# Altium project FishWand.PrjPcb
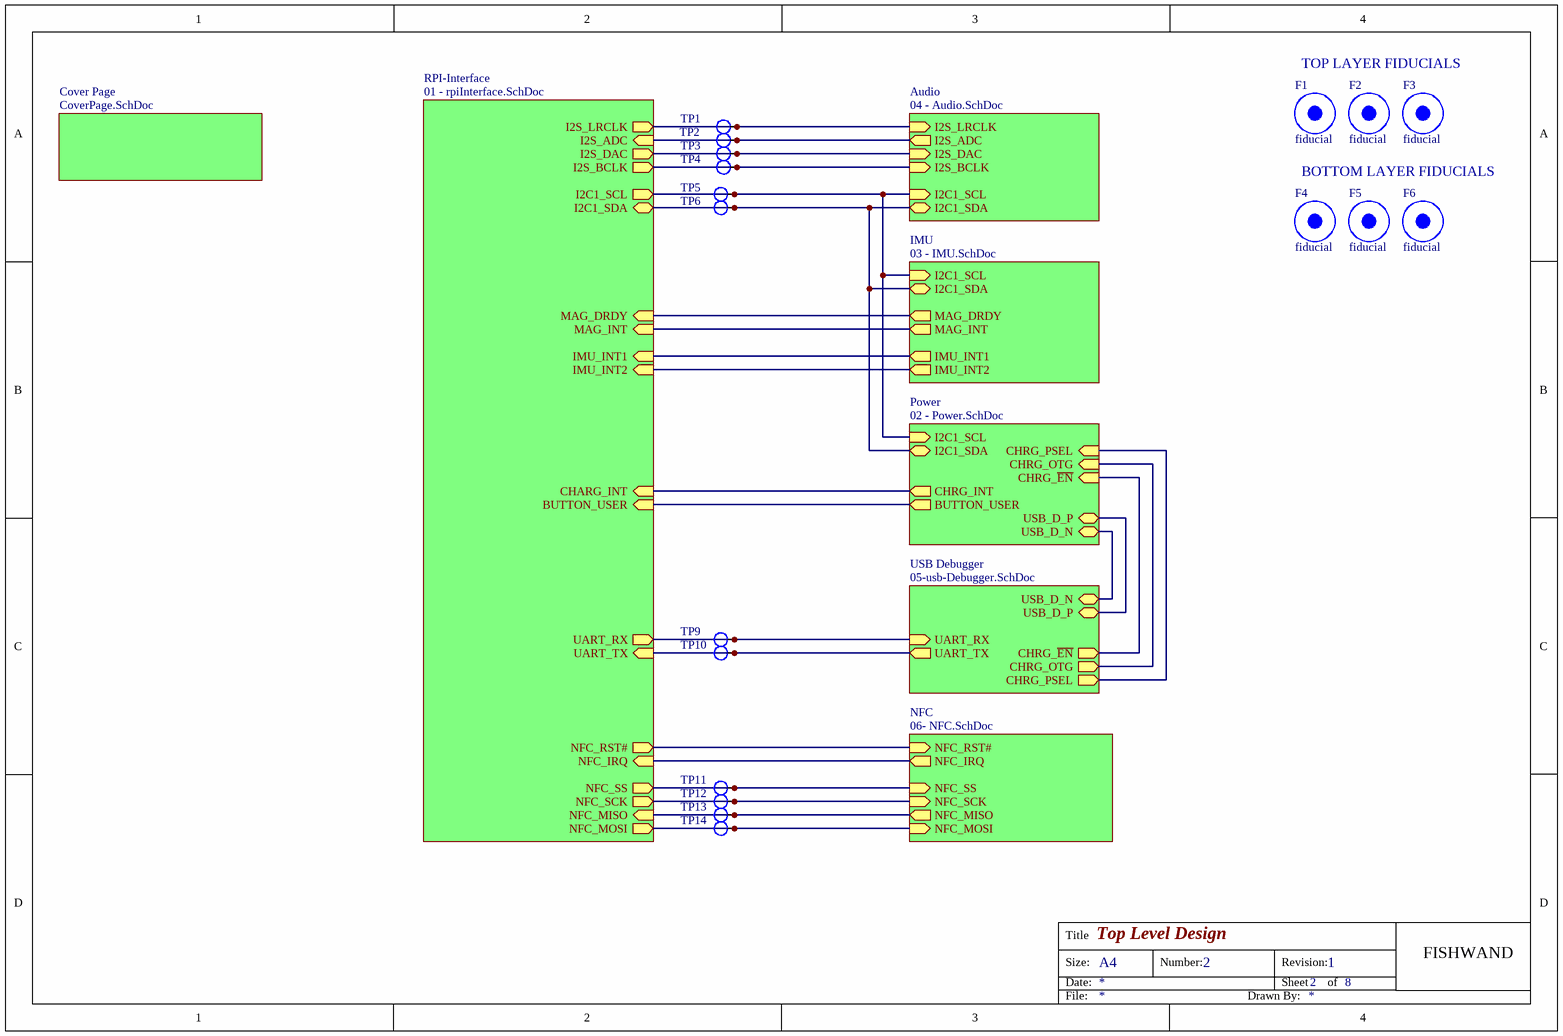
[diagram p0: 00 - TitlePage.SchDoc]
8 sheets, 208 parts. Net scope: hierarchical (ports join the sheet entries above them; power ports are global).
Sheets:
  00 - TitlePage.SchDoc
    RPI-Interface = 01 - rpiInterface.SchDoc
    Power = 02 - Power.SchDoc
    Audio = 04 - Audio.SchDoc
    IMU = 03 - IMU.SchDoc
    USB Debugger = 05-usb-Debugger.SchDoc
    NFC = 06- NFC.SchDoc
    Cover Page = CoverPage.SchDoc

## Sheet 00 - TitlePage.SchDoc: Top Level Design
size A4; DocumentNumber: 2; Revision: 1; SheetNumber: 2; SheetTotal: 8; ProjectName: FishWand

### Parts
F1  fiducial  [fiducial_marker]  (no BOM)
F2  fiducial  [fiducial_marker]  (no BOM)
F3  fiducial  [fiducial_marker]  (no BOM)
F4  fiducial  [fiducial_marker]  (no BOM)
F5  fiducial  [fiducial_marker]  (no BOM)
F6  fiducial  [fiducial_marker]  (no BOM)
TP1  Test Point  [tp_1mm]  (value not drawn)  (no BOM)
TP2  Test Point  [tp_1mm]  (value not drawn)  (no BOM)
TP3  Test Point  [tp_1mm]  (value not drawn)  (no BOM)
TP4  Test Point  [tp_1mm]  (value not drawn)  (no BOM)
TP5  Test Point  [tp_1mm]  (value not drawn)  (no BOM)
TP6  Test Point  [tp_1mm]  (value not drawn)  (no BOM)
TP9  Test Point  [tp_1mm]  (value not drawn)  (no BOM)
TP10  Test Point  [tp_1mm]  (value not drawn)  (no BOM)
TP11  Test Point  [tp_1mm]  (value not drawn)  (no BOM)
TP12  Test Point  [tp_1mm]  (value not drawn)  (no BOM)
TP13  Test Point  [tp_1mm]  (value not drawn)  (no BOM)
TP14  Test Point  [tp_1mm]  (value not drawn)  (no BOM)

### Sub-sheets
Audio = 04 - Audio.SchDoc: I2C1_SCL (in), I2S_BCLK (in), I2S_DAC (in), I2S_ADC (out), I2S_LRCLK (in), I2C1_SDA (bidir)
Cover Page = CoverPage.SchDoc: no entries
IMU = 03 - IMU.SchDoc: I2C1_SDA (bidir), I2C1_SCL (in), MAG_DRDY (out), MAG_INT (out), IMU_INT2 (out), IMU_INT1 (out)
NFC = 06- NFC.SchDoc: NFC_RST# (in), NFC_IRQ (out), NFC_SS (in), NFC_SCK (in), NFC_MISO (out), NFC_MOSI (in)
Power = 02 - Power.SchDoc: I2C1_SCL (in), I2C1_SDA (bidir), CHRG_INT (out), USB_D_P, USB_D_N, CHRG_~{EN} (in), CHRG_PSEL (in), BUTTON_USER (out), CHRG_OTG (in)
RPI-Interface = 01 - rpiInterface.SchDoc: I2C1_SCL (out), I2C1_SDA (bidir), UART_TX (in), I2S_LRCLK (out), CHARG_INT (in), I2S_ADC (in), I2S_BCLK (out), UART_RX (out), I2S_DAC (out), BUTTON_USER (in), NFC_IRQ (in), NFC_RST# (out), NFC_MISO (in), NFC_MOSI (out), NFC_SCK (out), NFC_SS (out), IMU_INT1 (in), IMU_INT2 (in), MAG_INT (in), MAG_DRDY (in)
USB Debugger = 05-usb-Debugger.SchDoc: CHRG_PSEL (out), USB_D_P, CHRG_~{EN} (out), CHRG_OTG (out), USB_D_N, UART_RX (in), UART_TX (out)

### Nets
CHRG_EN: sheet Power/CHRG_~{EN}, sheet USB Debugger/CHRG_~{EN}
CHRG_INT: sheet RPI-Interface/CHARG_INT, sheet Power/CHRG_INT
CHRG_OTG: sheet Power/CHRG_OTG, sheet USB Debugger/CHRG_OTG
CHRG_PSEL: sheet Power/CHRG_PSEL, sheet USB Debugger/CHRG_PSEL
I2C1_SCL: TP5.1 ; sheet RPI-Interface/I2C1_SCL, sheet Power/I2C1_SCL, sheet Audio/I2C1_SCL, sheet IMU/I2C1_SCL
I2C1_SDA: TP6.1 ; sheet RPI-Interface/I2C1_SDA, sheet Power/I2C1_SDA, sheet Audio/I2C1_SDA, sheet IMU/I2C1_SDA
I2S_ADC: TP2.1 ; sheet RPI-Interface/I2S_ADC, sheet Audio/I2S_ADC
I2S_BCLK: TP4.1 ; sheet RPI-Interface/I2S_BCLK, sheet Audio/I2S_BCLK
I2S_DAC: TP3.1 ; sheet RPI-Interface/I2S_DAC, sheet Audio/I2S_DAC
I2S_LRCLK: TP1.1 ; sheet RPI-Interface/I2S_LRCLK, sheet Audio/I2S_LRCLK
IMU_INT1: sheet RPI-Interface/IMU_INT1, sheet IMU/IMU_INT1
IMU_INT2: sheet RPI-Interface/IMU_INT2, sheet IMU/IMU_INT2
MAG_DRDY: sheet RPI-Interface/MAG_DRDY, sheet IMU/MAG_DRDY
MAG_INT: sheet RPI-Interface/MAG_INT, sheet IMU/MAG_INT
NFC_IRQ: sheet RPI-Interface/NFC_IRQ, sheet NFC/NFC_IRQ
NFC_RST#: sheet RPI-Interface/NFC_RST#, sheet NFC/NFC_RST#
NFC_SS: TP11.1 ; sheet RPI-Interface/NFC_SS, sheet NFC/NFC_SS
PI_UART_RX: TP9.1 ; sheet RPI-Interface/UART_RX, sheet USB Debugger/UART_RX
PI_UART_TX: TP10.1 ; sheet RPI-Interface/UART_TX, sheet USB Debugger/UART_TX
SPI_MISO: TP13.1 ; sheet RPI-Interface/NFC_MISO, sheet NFC/NFC_MISO
SPI_MOSI: TP14.1 ; sheet RPI-Interface/NFC_MOSI, sheet NFC/NFC_MOSI
SPI_SCK: TP12.1 ; sheet RPI-Interface/NFC_SCK, sheet NFC/NFC_SCK
USB_N: sheet Power/USB_D_N, sheet USB Debugger/USB_D_N
USB_P: sheet Power/USB_D_P, sheet USB Debugger/USB_D_P
NetJ1_37: sheet RPI-Interface/BUTTON_USER, sheet Power/BUTTON_USER

### Notes on the sheet
- TOP LAYER FIDUCIALS
- BOTTOM LAYER FIDUCIALS
- Title
- Size:
- Date:
- A4
- Number:
- Revision:
- Sheet
- of
- FISHWAND
- File:
- Drawn By:

### Library data of the parts
F1-F6 = fiducial_marker
TP1-TP6 TP9-TP14 = TP_1mm

## Sheet 01 - rpiInterface.SchDoc: Raspberry Pi Interface
size A4; DrawnBy: Trevor Charmley; Engineer: Trevor Charmley; DocumentNumber: 3; Revision: 1; SheetNumber: 3; SheetTotal: 8
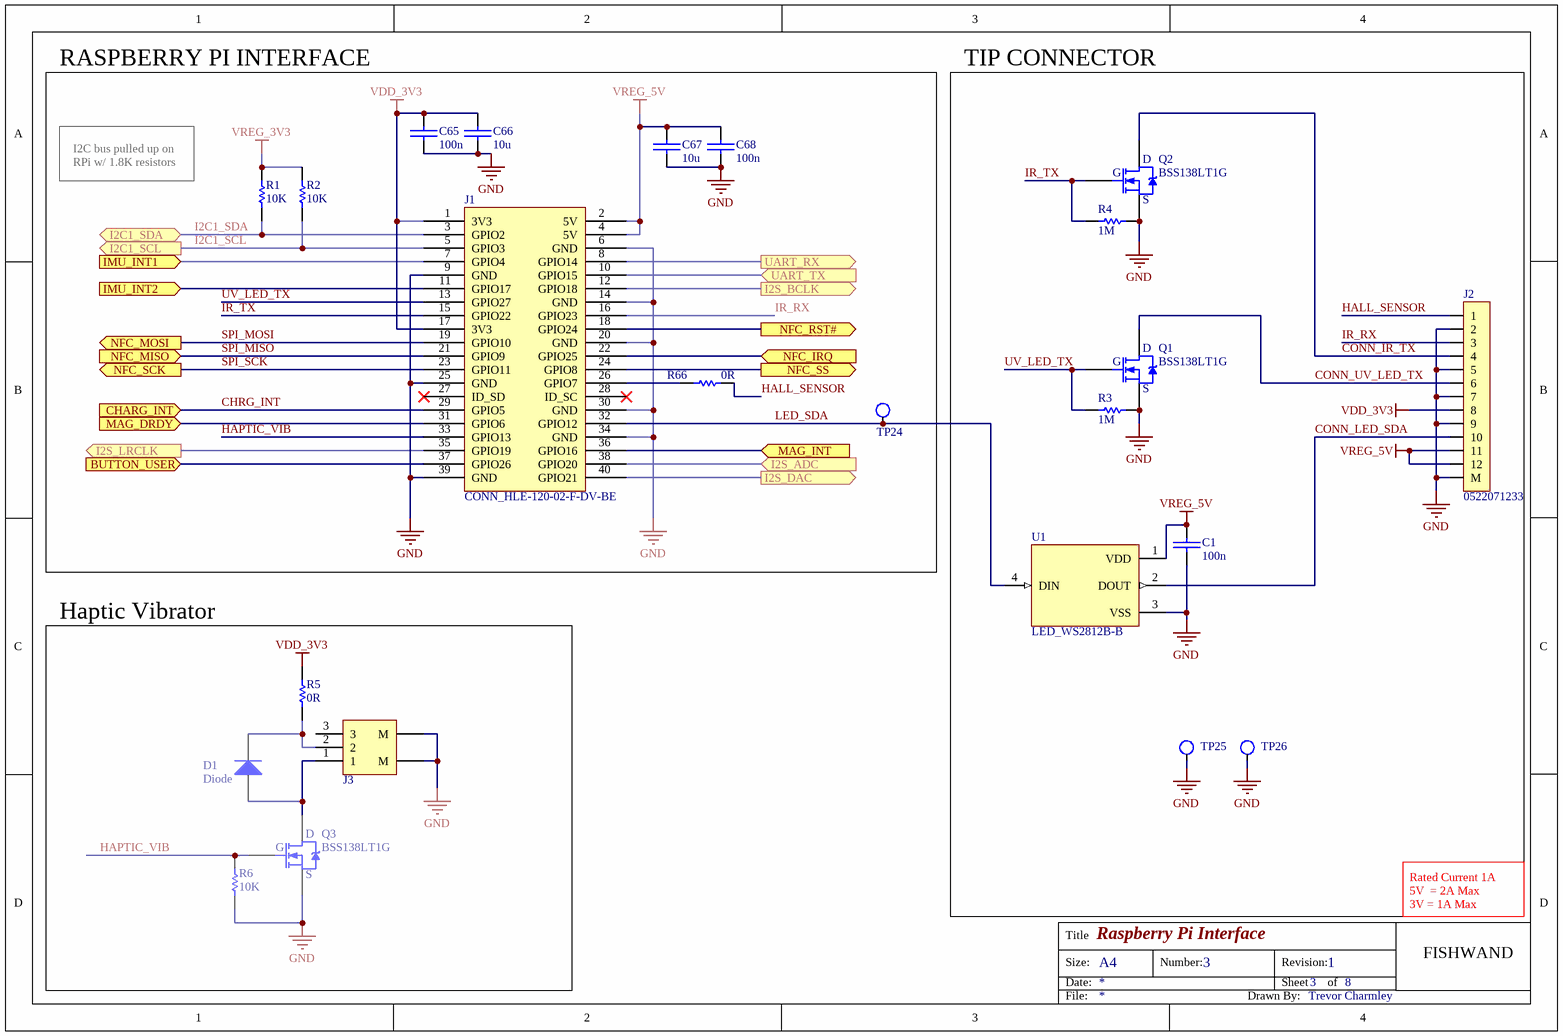
[diagram p1: 01 - rpiInterface.SchDoc]

### Parts
C1  100n  [CAPC100X50X65]
C65  100n  [CAPC100X50X65]
C66  10u  [CAPC100X50X65]
C67  10u  [CAPC100X50X65]
C68  100n  [CAPC100X50X65]
D1  Diode  [D_SOD_323F]
J1  CONN_HLE-120-02-F-DV-BE  [SAMTEC_HLE-120-02-F-DV-BE]
J2  0522071233  [CONN_0522711279]
J3  BM03B-ADHKS-GAN-ETB  [J_JST_BM03B-ADHKS-GAN-ETB]  (value not drawn)
Q1  BSS138LT1G  [SOT23-3P95_240X111L42X43N]
Q2  BSS138LT1G  [SOT23-3P95_240X111L42X43N]
Q3  BSS138LT1G  [SOT23-3P95_240X111L42X43N]
R1  10K  [RESC0402]
R2  10K  [RESC0402]
R3  1M  [RESC0402]
R4  1M  [RESC0402]
R5  0R  [RESC0402]
R6  10K  [RESC0402]
R66  0R  [RESC0402]
TP24  Test Point  [tp_1mm]  (value not drawn)  (no BOM)
TP25  Test Point  [tp_1mm]  (value not drawn)  (no BOM)
TP26  Test Point  [tp_1mm]  (value not drawn)  (no BOM)
U1  LED_WS2812B-B  [LED_WS2812B-B]

### Blocks framed on the sheet
RASPBERRY PI INTERFACE: C65-C68 J1 R1 R2 R66 TP24
TIP CONNECTOR: C1 J2 Q1 Q2 R3 R4 TP25 TP26 U1
Haptic Vibrator: D1 J3 Q3 R5 R6

### Ports
BUTTON_USER (in), CHARG_INT (in), I2C1_SCL (out), I2C1_SDA (bidir), I2S_ADC (in), I2S_BCLK (out), I2S_DAC (out), I2S_LRCLK (out), IMU_INT1 (in), IMU_INT2 (in), MAG_DRDY (in), MAG_INT (in), NFC_IRQ (in), NFC_MISO (in), NFC_MOSI (out), NFC_RST# (out), NFC_SCK (out), NFC_SS (out), UART_RX (out), UART_TX (in)

### Nets
GND: C1.2 C65.2 C66.2 C67.2 C68.2 J1.6(GND) J1.9(GND) J1.14(GND) J1.20(GND) J1.25(GND) J1.30(GND) J1.34(GND) J1.39(GND) J2.2 J2.5 J2.7 J2.9 J2.M J3.0(M) Q1.2(S) Q2.2(S) Q3.2(S) R3.1 R4.1 R6.1 TP25.1 TP26.1 U1.3(VSS)
VDD_3V3: C65.1 C66.1 J1.1(3V3) J1.17(3V3) J2.8 R5.2
VREG_3V3: R1.2 R2.2
VREG_5V: C1.1 C67.1 C68.1 J1.2(5V) J1.4(5V) J2.11 J2.12 U1.1(VDD)
CHRG_INT: J1.29(GPIO5) ; port CHARG_INT
CONN_IR_TX: J2.4 Q2.3(D)
CONN_LED_SDA: J2.10 U1.2(DOUT)
CONN_UV_LED_TX: J2.6 Q1.3(D)
HALL_SENSOR: J2.1 R66.2
HAPTIC_VIB: J1.33(GPIO13) Q3.1(G) R6.2
I2C1_SCL: J1.5(GPIO3) R2.1 ; port I2C1_SCL
I2C1_SDA: J1.3(GPIO2) R1.1 ; port I2C1_SDA
I2S_ADC: J1.38(GPIO20) ; port I2S_ADC
I2S_BCLK: J1.12(GPIO18) ; port I2S_BCLK
I2S_DAC: J1.40(GPIO21) ; port I2S_DAC
I2S_LRCLK: J1.35(GPIO19) ; port I2S_LRCLK
IMU_INT1: J1.7(GPIO4) ; port IMU_INT1
IMU_INT2: J1.11(GPIO17) ; port IMU_INT2
IR_RX: J1.16(GPIO23) J2.3
IR_TX: J1.15(GPIO22) Q2.1(G) R4.2
LED_SDA: J1.32(GPIO12) TP24.1 U1.4(DIN)
MAG_DRDY: J1.31(GPIO6) ; port MAG_DRDY
MAG_INT: J1.36(GPIO16) ; port MAG_INT
NFC_IRQ: J1.22(GPIO25) ; port NFC_IRQ
NFC_RST#: J1.18(GPIO24) ; port NFC_RST#
NFC_SS: J1.24(GPIO8) ; port NFC_SS
PI_UART_RX: J1.8(GPIO14) ; port UART_RX
PI_UART_TX: J1.10(GPIO15) ; port UART_TX
SPI_MISO: J1.21(GPIO9) ; port NFC_MISO
SPI_MOSI: J1.19(GPIO10) ; port NFC_MOSI
SPI_SCK: J1.23(GPIO11) ; port NFC_SCK
UV_LED_TX: J1.13(GPIO27) Q1.1(G) R3.2
NetD1_1: D1.1(K) J3.2 R5.1
NetD1_2: D1.2(A) J3.1 Q3.3(D)
NetJ1_26: J1.26(GPIO7) R66.1
NetJ1_37: J1.37(GPIO26) ; port BUTTON_USER

Not connected (* = marked no-connect by the designer): J1 27(ID_SD)* 28(ID_SC)*; J3 3

### Notes on the sheet
- I2C bus pulled up on RPi w/ 1.8K resistors
- Rated Current 1A
  5V  = 2A Max
  3V = 1A Max
- Title
- Size:
- Date:
- A4
- Number:
- Revision:
- Sheet
- of
- FISHWAND
- File:
- Drawn By:

### Library data of the parts
C1 C65 C68 = C_100NF_25V_X5R_0402: CAP CER 100nF 25V X5R 0402; Manufacturer: Murata Electronics; Manufacturer PN: GRM155R61E104KA87D; Supplier: Digi-Key; Supplier PN: 490-5920-2-ND
C66 C67 = C_10UF_10V_X5R_0402: CAP CER 10UF 10V X5R 0402; Manufacturer: Samsung Electro-Mechanics; Manufacturer PN: CL05A106MP5NUNC; Supplier PN: 1276-1450-1-ND
D1 = D_SOD_323_75V_150mA: DIODE GEN PURP 75V 150MA SOD323F; Manufacturer: onsemi; Manufacturer PN: 1N4148WS; Supplier: *; Supplier PN: *; Package / Case: SC-90, SOD-323F
J1 = CONN_HLE-120-02-F-DV-BE: Manufacturer: Samtec; Manufacturer PN: HLE-120-02-F-DV-BE; Availability: Unavailable; Price: None; Value: *
J2 = CONN_FPC_Bottom 12POS_1MM_0522711279: CONN FPC BOTTOM 12POS 1.00MM R/A; Manufacturer: Molex; Manufacturer PN: 0522711279; Supplier: Digi-Key; Supplier PN: WM7960CT-ND; Package / Case: *
J3 = CONN _HEADER SMD_3POS_1.3MM: CONN HEADER SMD R/A 3POS 1.3MM; Manufacturer: JST Sales America Inc.; Manufacturer PN: BM03B-ADHKS-GAN-ETB; Supplier: Digi-Key; Supplier PN: 455-2900-1-ND; ComponentLink1Description: Datasheet; ComponentLink1URL: http://www.jst-mfg.com/product/pdf/eng/eADH.pdf
Q1-Q3 = TRANS_MOSFET_N_50V_200MA_SOT23: MOSFET N-CH 50V 200MA SOT-23; Manufacturer: ON Semiconductor; Manufacturer PN: BSS138LT1G; Type: MOSFET N-CH; Supplier PN: BSS138LT1GOSCT-ND
R1 R2 R6 = R_0402_10K_1%: 10 kOhms ±1% 0.063W, 1/16W Chip Resistor 0402 (1005 Metric) Moisture Resistant Thick Film; Manufacturer: YAGEO; Manufacturer PN: RC0402FR-0710KL; Supplier: *; Supplier PN: *; Value: 10K; Tolerance: 1%; Package / Case: 0402
R3 R4 = R_0402_1M_1%: 1 MOhms ±1% 0.063W, 1/16W Chip Resistor 0402 (1005 Metric) Moisture Resistant Thick Film; Manufacturer: YAGEO; Manufacturer PN: RC0402FR-071ML; Supplier: Digi-Key; Supplier PN: 311-1.00MLRTR-ND; Value: 1M; Tolerance: 1%; Package / Case: 0402
R5 R66 = R_0402_0R_5%: 0 Ohms Jumper 0.063W, 1/16W Chip Resistor 0402 (1005 Metric) Thick Film; Manufacturer: YAGEO; Manufacturer PN: RC0402JR-070RP; Tolerance: 5%; Supplier: *; Supplier PN: *; Value: 0R; Package / Case: 0402
TP24-TP26 = TP_1mm
U1 = LED_WS2812B-B: Intelligent control LED integrated light source; Manufacturer PN: WS2812B-V5; Manufacturer: Worldsemi; Package / Case: 5050; Value: *; Price: None; Availability: Unavailable

## Sheet 02 - Power.SchDoc: Power Supply
size A4; DrawnBy: Trevor Charmley; DocumentNumber: 4; Revision: 1; SheetNumber: 4; SheetTotal: 8
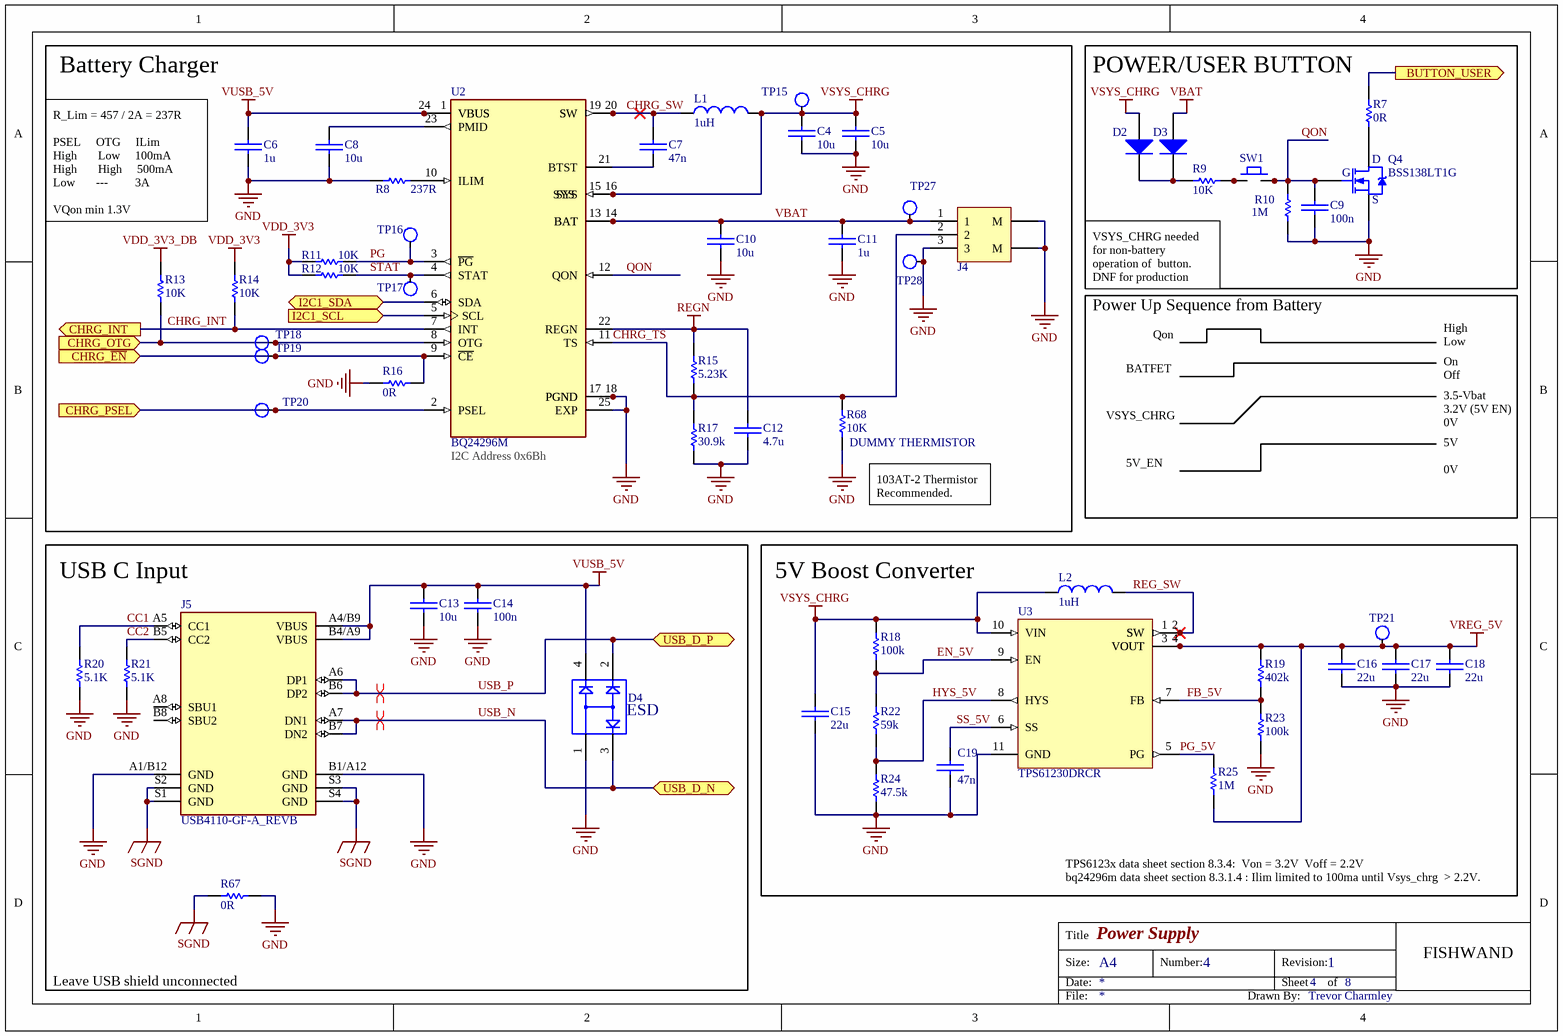
[diagram p2: 02 - Power.SchDoc]

### Parts
C4  10u  [CAPC100X50X65]
C5  10u  [CAPC100X50X65]
C6  1u  [CAPC100X50X65]
C7  47n  [CAPC100X50X65]
C8  10u  [CAPC100X50X65]
C9  100n  [CAPC100X50X65]
C10  10u  [CAPC100X50X65]
C11  1u  [CAPC100X50X65]
C12  4.7u  [CAPC100X50X65]
C13  10u  [CAPC100X50X65]
C14  100n  [CAPC100X50X65]
C15  22u  [CAPC200X125X140L45N]
C16  22u  [CAPC200X125X140L45N]
C17  22u  [CAPC200X125X140L45N]
C18  22u  [CAPC200X125X140L45N]
C19  47n  [CAPC100X50X65]
D2  Diode  [D_SOD_323F]  (value not drawn)
D3  Diode  [D_SOD_323F]  (value not drawn)
D4  SP0503BAHTG_8.5V_TVS_DIODE  [SOT143]  (value not drawn)
J4  BM03B-ADHKS-GAN-ETB  [J_JST_BM03B-ADHKS-GAN-ETB]  (value not drawn)
J5  USB4110-GF-A_REVB  [GCT_USB4110-GF-A_REVB]
L1  1uH  [IND1210]
L2  1uH  [IND1210]
Q4  BSS138LT1G  [SOT23-3P95_240X111L42X43N]
R7  0R  [RESC0402]
R8  237R  [RESC0402]
R9  10K  [RESC0402]
R10  1M  [RESC0402]
R11  10K  [RESC0402]
R12  10K  [RESC0402]
R13  10K  [RESC0402]
R14  10K  [RESC0402]
R15  5.23K  [RESC0402]
R16  0R  [RESC0402]
R17  30.9k  [RESC0402]
R18  100k  [RESC0402]
R19  402k  [RESC0402]
R20  5.1K  [RESC0402]
R21  5.1K  [RESC0402]
R22  59k  [RESC0402]
R23  100k  [RESC0402]
R24  47.5k  [RESC0402]
R25  1M  [RESC0402]
R67  0R  [RESC0402]
R68  10K  [RESC0402]
SW1  KSC621GLFS  [SW_KSC621GLFS]  (value not drawn)  (net tie)
TP15  Test Point  [tp_1mm]  (value not drawn)  (no BOM)
TP16  Test Point  [tp_1mm]  (value not drawn)  (no BOM)
TP17  Test Point  [tp_1mm]  (value not drawn)  (no BOM)
TP18  Test Point  [tp_1mm]  (value not drawn)  (no BOM)
TP19  Test Point  [tp_1mm]  (value not drawn)  (no BOM)
TP20  Test Point  [tp_1mm]  (value not drawn)  (no BOM)
TP21  Test Point  [tp_1mm]  (value not drawn)  (no BOM)
TP27  Test Point  [tp_1mm]  (value not drawn)  (no BOM)
TP28  Test Point  [tp_1mm]  (value not drawn)  (no BOM)
U2  BQ24296M  [QFN50P400X400X100-25N]
U3  TPS61230DRCR  [VREG_V62/16624-01YE]

### Blocks framed on the sheet
Battery Charger: C4-C8 C10-C12 J4 L1 R8 R11-R17 R68 TP15-TP20 TP27 TP28 U2
POWER/USER BUTTON: C9 D2 D3 Q4 R7 R9 R10 SW1
USB C Input: C13 C14 D4 J5 R20 R21 R67
5V Boost Converter: C15-C19 L2 R18 R19 R22-R25 TP21 U3

### Ports
BUTTON_USER (out), CHRG_INT (out), CHRG_OTG (in), CHRG_PSEL (in), CHRG_~{EN} (in), I2C1_SCL (in), I2C1_SDA (bidir), USB_D_N, USB_D_P

### Nets
GND: C4.2 C5.2 C6.2 C8.1 C9.2 C10.2 C11.2 C12.1 C13.2 C14.2 C15.1 C16.1 C17.1 C18.1 C19.2 D4.1 J4.0(M) J4.3 J5.A1/B12(GND) J5.B1/A12(GND) Q4.2(S) R8.1 R10.1 R16.1 R17.1 R20.1 R21.1 R23.1 R24.1 R67.2 R68.1 TP28.1 U2.17(PGND) U2.18(PGND) U2.25(EXP) U3.11(GND)
REGN: C12.2 R15.2 U2.22(REGN)
SGND: J5.S1(GND) J5.S2(GND) J5.S3(GND) J5.S4(GND) R67.1
VBAT: C10.1 C11.1 D3.2(A) J4.1 TP27.1 U2.13(BAT) U2.14(BAT)
VDD_3V3: R11.2 R12.2 R14.2
VDD_3V3_DB: R13.2
VREG_5V: C16.2 C17.2 C18.2 R19.2 R25.1 TP21.1 U3.3(VOUT) U3.4(VOUT)
VSYS_CHRG: C4.1 C5.1 C15.2 D2.2(A) L1.2 L2.1 R18.2 TP15.1 U2.15(SYS) U2.16(SYS) U3.10(VIN)
VUSB_5V: C6.1 C13.1 C14.1 D4.4 J5.A4/B9(VBUS) J5.B4/A9(VBUS) U2.1(VBUS) U2.24(VBUS)
CC1: J5.A5(CC1) R20.2
CC2: J5.B5(CC2) R21.2
CHRG_EN: R16.2 TP19.1 U2.9(~{CE}) ; port CHRG_~{EN}
CHRG_INT: R14.1 U2.7(INT) ; port CHRG_INT
CHRG_OTG: R13.1 TP18.1 U2.8(OTG) ; port CHRG_OTG
CHRG_PSEL: TP20.1 U2.2(PSEL) ; port CHRG_PSEL
CHRG_SW: C7.1 L1.1 U2.19(SW) U2.20(SW)
CHRG_TS: J4.2 R15.1 R17.2 R68.2 U2.11(TS)
EN_5V: R18.1 R22.2 U3.9(EN)
FB_5V: R19.1 R23.2 U3.7(FB)
HYS_5V: R22.1 R24.2 U3.8(HYS)
I2C1_SCL: U2.5(SCL) ; port I2C1_SCL
I2C1_SDA: U2.6(SDA) ; port I2C1_SDA
PG: R11.1 TP16.1 U2.3(~{PG})
PG_5V: R25.2 U3.5(PG)
QON: C9.1 Q4.1(G) R10.2 SW1.2 SW1.4 U2.12(QON)
REG_SW: L2.2 U3.1(SW) U3.2(SW)
SS_5V: C19.1 U3.6(SS)
STAT: R12.1 TP17.1 U2.4(STAT)
USB_N: D4.3 J5.A7(DN1) J5.B7(DN2) ; port USB_D_N
USB_P: D4.2 J5.A6(DP1) J5.B6(DP2) ; port USB_D_P
NetC7_2: C7.2 U2.21(BTST)
NetC8_2: C8.2 U2.23(PMID)
NetD2_1: D2.1(K) D3.1(K) R9.2
NetJ1_37: R7.1 ; port BUTTON_USER
NetQ4_3: Q4.3(D) R7.2
NetR8_2: R8.2 U2.10(ILIM)
NetR9_1: R9.1 SW1.1 SW1.3

Not connected (* = marked no-connect by the designer): J5 A8(SBU1) B8(SBU2)

### Layout directives
differential pair: USB_N, USB_P

### Notes on the sheet
- R_Lim = 457 / 2A = 237R
  PSEL     OTG     ILim
  High       Low     100mA
  High       High     500mA
  Low       ---         3A
  VQon min 1.3V
- VSYS_CHRG needed for non-battery operation of  button. DNF for production
- Power Up Sequence from Battery
- BATFET
- Qon
- High
- Low
- On
- Off
- (near R68) DUMMY THERMISTOR
- VSYS_CHRG
- 3.5-Vbat
- 3.2V (5V EN)
- 5V
- 0V
- (near U2) I2C Address 0x6Bh
- (near R68) 103AT-2 Thermistor Recommended.
- 5V_EN
- (near D4) ESD
- TPS6123x data sheet section 8.3.4:  Von = 3.2V  Voff = 2.2V
  bq24296m data sheet section 8.3.1.4 : Ilim limited to 100ma until Vsys_chrg  > 2.2V.
- Leave USB shield unconnected
- Title
- Size:
- Date:
- A4
- Number:
- Revision:
- Sheet
- of
- FISHWAND
- File:
- Drawn By:

### Library data of the parts
C4 C5 C8 C10 C13 = C_10UF_10V_X5R_0402: as C66 on sheet 01 - rpiInterface; Supplier PN: 1276-1450-1-ND
C6 C11 = C_1UF_25V_X5R_0402_1: CAP CER 1UF 25V X5R 0402; Manufacturer: Murata Electronics North America; Manufacturer PN: GRT155R61E105KE01D; Supplier PN: 490-12263-2-ND
C7 C19 = C_47nF_25V_XR7_10%_0402: CAP CER 0.047UF 25V X7R 0402; Manufacturer: Murata Electronics; Manufacturer PN: GRM155R71E473KA88D; Value: 47nF; Supplier: Digi-Key; Supplier PN: 490-3254-2-ND
C9 C14 = C_100NF_25V_X5R_0402: as C1 on sheet 01 - rpiInterface; Supplier: Digi-Key; Supplier PN: 490-5920-2-ND
C12 = C_4.7UF_10V_X5R_0402: CAP CER 4.7UF 10V X5R 0402; Manufacturer: Murata Electronics North America; Manufacturer PN: GRM155R61A475MEAAD; Supplier PN: 490-14306-1-ND
C15-C18 = C_22uF_10V_0805_20%: CAP CER 22UF 10V X5R 0805; Manufacturer PN: GRM21BR61A226ME51L; Manufacturer: Murata Electronics North America; RoHS: YES; Type: Cer; Supplier PN: 490-10511-1-ND; Value: 22uF
D2 D3 = D_SOD_323_75V_150mA: as D1 on sheet 01 - rpiInterface; Supplier: *; Supplier PN: *; Package / Case: SC-90, SOD-323F
D4 = SP0503BAHTG_8.5V_TVS_DIODE: 8.5V Clamp Ipp Tvs Diode Surface Mount SOT-143-4; Manufacturer: Littelfuse Inc.; Manufacturer PN: SP0503BAHTG; SnapEDA_Link: https://www.snapeda.com/parts/SP0503BAHTG/Littelfuse%20Inc./view-part/214427/?ref=snap; Digi-Key_Purchase_URL: https://www.digikey.com/product-detail/en/littelfuse-inc/SP0503BAHTG/F2715CT-ND/1154322?utm_source=snapeda&utm_medium=aggregator&utm_campaign=symbol; Value: *; Digi-Key_Part_Number: F2715CT-ND; Package / Case: SOT-143 Littelfuse
J4 = CONN _HEADER SMD_3POS_1.3MM: as J3 on sheet 01 - rpiInterface; Manufacturer PN: BM03B-ADHKS-GAN-ETB; Supplier: Digi-Key; Supplier PN: 455-2900-1-ND; ComponentLink1Description: Datasheet; ComponentLink1URL: http://www.jst-mfg.com/product/pdf/eng/eADH.pdf
J5 = USB4110-GF-A_REVB: USB-C (USB TYPE-C) USB 2.0 Receptacle Connector 24 (16+8 Dummy) Position Surface Mount, Right Angle; Through Hole; Manufacturer: GCT; Value: *; Price: 1.41; SnapEDA_Link: https://www.snapeda.com/parts/USB4110-GF-A/Global%20Connector%20Technology/view-part/4001167/?ref=snap; Availability: Warning; Check_prices: https://www.snapeda.com/parts/USB4110-GF-A/Global%20Connector%20Technology/view-part/4001167/?ref=eda; Manufacturer PN: USB4110-GF-A; Supplier: Digi-Key; Supplier PN: 2073-USB4110-GF-A-2-ND; Package / Case: USB TYPE-C
L1 L2 = L_1210_1uH_5.5A: 1 µH Shielded Drum Core, Wirewound Inductor 5.5 A 32mOhm Max 1210 (3225 Metric); Manufacturer: Bourns Inc.; Manufacturer PN: SRP3212-1R0M; Tolerance: 20%; Supplier: Digi-Key; Supplier PN: 118-SRP3212-1R0MTR-ND; Value: 1uH; Package / Case: 1210 (3225 Metric)
Q4 = TRANS_MOSFET_N_50V_200MA_SOT23: as Q1 on sheet 01 - rpiInterface; Manufacturer PN: BSS138LT1G; Type: MOSFET N-CH; Supplier PN: BSS138LT1GOSCT-ND
R7 R16 R67 = R_0402_0R_5%: as R5 on sheet 01 - rpiInterface; Supplier: *; Supplier PN: *; Value: 0R; Package / Case: 0402
R8 = R_0402_237R_1%: 237 Ohms ±1% 0.063W, 1/16W Chip Resistor 0402 (1005 Metric) Moisture Resistant Thick Film; Manufacturer: YAGEO; Manufacturer PN: RC0402FR-07237RL; Supplier: Digi-Key; Supplier PN: YAG3065TR-ND; Value: 237R; Tolerance: 1%; Package / Case: 0402
R9 R11-R14 R68 = R_0402_10K_1%: as R1 on sheet 01 - rpiInterface; Supplier: *; Supplier PN: *; Value: 10K; Tolerance: 1%; Package / Case: 0402
R10 R25 = R_0402_1M_1%: as R3 on sheet 01 - rpiInterface; Supplier: Digi-Key; Supplier PN: 311-1.00MLRTR-ND; Value: 1M; Tolerance: 1%; Package / Case: 0402
R15 = R_0402_5.23k_1%: 5.23 kOhms ±1% 0.063W, 1/16W Chip Resistor 0402 (1005 Metric) Moisture Resistant Thick Film; Manufacturer: YAGEO; Manufacturer PN: RC0402FR-075K23L; Supplier: Digi-Key; Supplier PN: YAG3195TR-ND; Value: 5.23K; Tolerance: 1%; Package / Case: 0402
R17 = R_0402_30.9k_1%: RES 30.9K OHM 1% 1/16W 0402; Manufacturer: YAGEO; Manufacturer PN: RC0402FR-0730K9L; Supplier: Digi-Key; Supplier PN: YAG3110TR-ND; Value: 30.9K; Tolerance: 1%; Package / Case: 0402
R18 R23 = R_0402_100k_1%: 100 kOhms ±1% 0.063W, 1/16W Chip Resistor 0402 (1005 Metric) Moisture Resistant Thick Film; Manufacturer: YAGEO; Manufacturer PN: RC0402FR-07100KL; Supplier: Digi-Key; Supplier PN: 311-100KLRTR-ND; Value: 100k; Tolerance: 1%; Package / Case: 0402
R19 = R_0402_402k_1%: 402 kOhms ±1% 0.063W, 1/16W Chip Resistor 0402 (1005 Metric) Moisture Resistant Thick Film; Manufacturer: YAGEO; Manufacturer PN: RC0402FR-07402KL; Supplier: Digi-Key; Supplier PN: YAG3151TR-ND; Value: 402k; Tolerance: 1%; Package / Case: 0402
R20 R21 = R_0402_5.1K_1%_1: 5.1 kOhms ±1% 0.063W, 1/16W Chip Resistor 0402 (1005 Metric) Moisture Resistant Thick Film; Manufacturer: YAGEO; Manufacturer PN: RC0402FR-075K1L; Supplier: Digi-Key; Supplier PN: 311-5.10KLRTR-ND; Value: 5.1K; Tolerance: 1%; Package / Case: 0402
R22 = R_0402_59k_1%: 59 kOhms ±1% 0.063W, 1/16W Chip Resistor 0402 (1005 Metric) Moisture Resistant Thick Film; Manufacturer: YAGEO; Manufacturer PN: RC0402FR-0759KL; Supplier: Digi-Key; Supplier PN: 311-59KLRTR-ND; Value: 59k; Package / Case: 0402
R24 = R_0402_47.5K_1%: 47.5 kOhms ±1% 0.063W, 1/16W Chip Resistor 0402 (1005 Metric) Moisture Resistant Thick Film; Manufacturer: YAGEO; Manufacturer PN: RC0402FR-0747K5L; Supplier: *; Supplier PN: *; Value: 47.5k; Tolerance: 1%; Package / Case: 0402
SW1 = SWITCH_TACTILE_SPST-NO_0.05A_32V: Manufacturer: C&K; Manufacturer PN: KSC621GLFS; Supplier PN: 401-1786-2-ND; Supplier: Digi-Key
TP15-TP21 TP27 TP28 = TP_1mm
U2 = BQ24296MRGER: Charger IC Lithium Ion/Polymer 24-VQFN (4x4); Manufacturer: TI; Price: 4.05; Availability: Unavailable; Package / Case: VQFN-24; Supplier PN: 595-BQ24296MRGER; Manufacturer PN: BQ24296MRGER; Supplier: Mouser
U3 = U_Vreg_5V_TPS61230DRCR: High Efficiency Synchronous Boost Converter With 5-A Switch 10-VSON -40 to 85; Manufacturer: Texas Instruments; Value: *; Availability: Unavailable; Package / Case: VSON-10 Texas Instruments; Texas_Instruments-Purchase-URL: https://snapeda.com/shop?store=Texas+Instruments&id=51762; Price: None; SnapEDA_Link: https://www.snapeda.com/parts/TPS61230DRCR/Texas%20Instruments/view-part/51762/?ref=snap; BuyPart: https://www.snapeda.com/parts/TPS61230DRCR/Texas%20Instruments/view-part/51762/?ref=eda; Supplier: Digi-Key; Supplier PN: 296-37761-2-ND; Manufacturer PN: TPS61230DRCR

## Sheet 04 - Audio.SchDoc: Audio
size A4; DrawnBy: Trevor Charmley; DocumentNumber: 6; Revision: 1; SheetNumber: 6; SheetTotal: 8
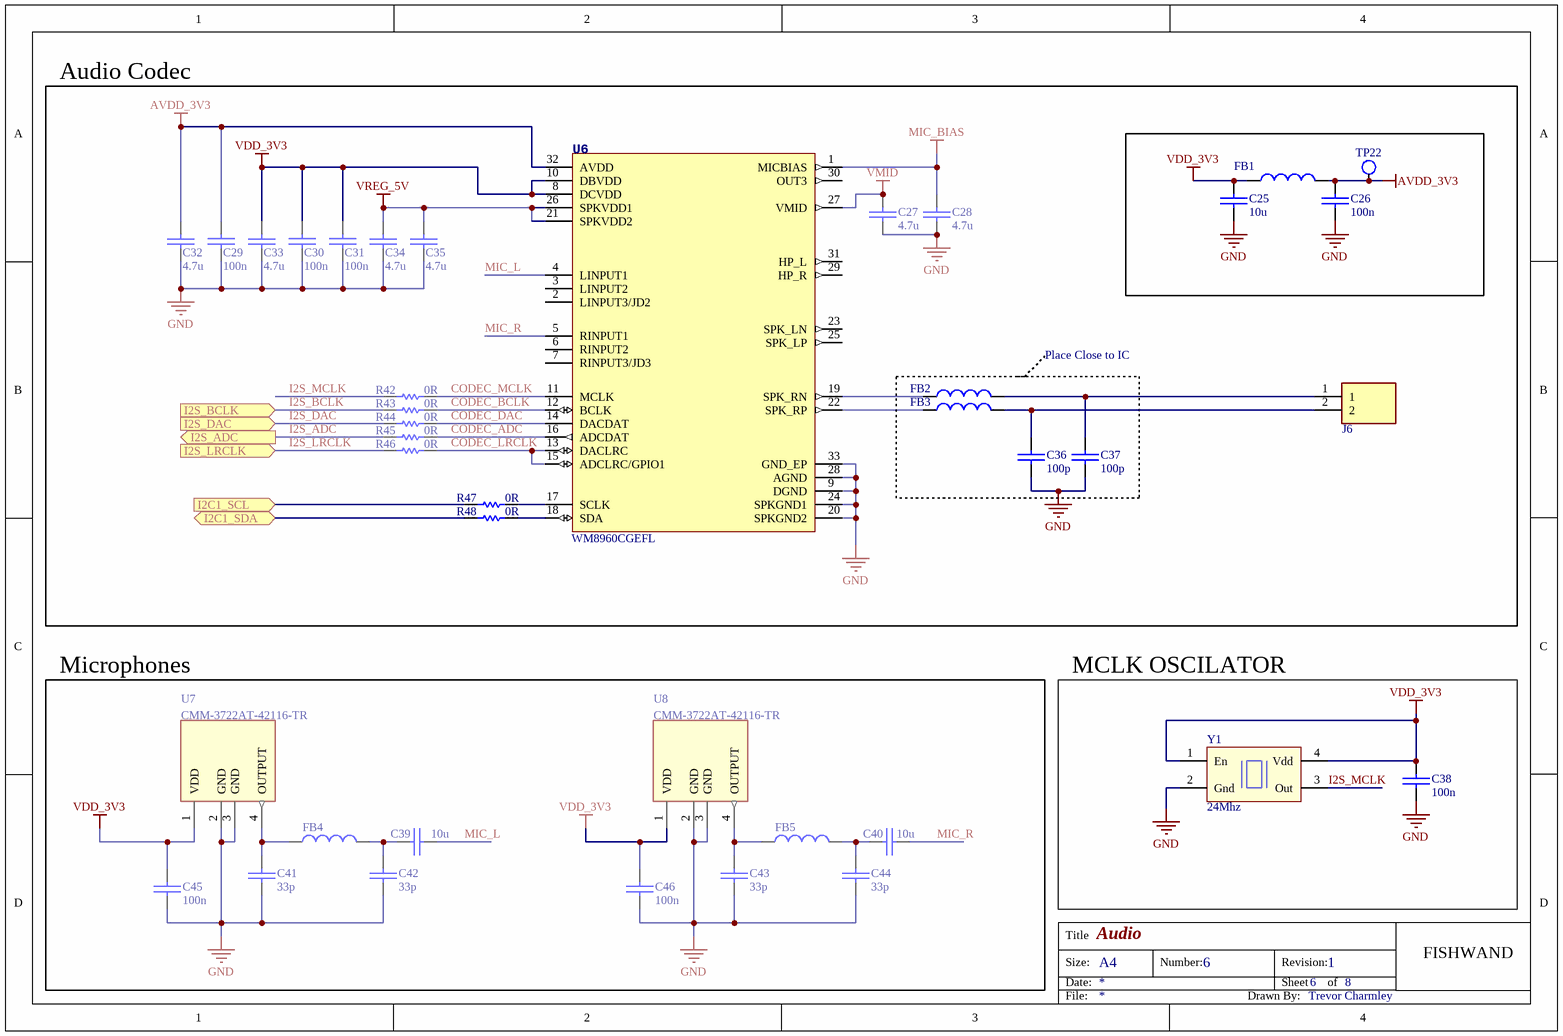
[diagram p3: 04 - Audio.SchDoc]

### Parts
C25  10u  [CAPC100X50X65]
C26  100n  [CAPC100X50X65]
C27  4.7u  [CAPC100X50X65]
C28  4.7u  [CAPC100X50X65]
C29  100n  [CAPC100X50X65]
C30  100n  [CAPC100X50X65]
C31  100n  [CAPC100X50X65]
C32  4.7u  [CAPC100X50X65]
C33  4.7u  [CAPC100X50X65]
C34  4.7u  [CAPC100X50X65]
C35  4.7u  [CAPC100X50X65]
C36  100p  [CAPC100X50X65]
C37  100p  [CAPC100X50X65]
C38  100n  [CAPC100X50X65]
C39  10u  [CAPC100X50X65]
C40  10u  [CAPC100X50X65]
C41  33p  [CAPC100X50X65]
C42  33p  [CAPC100X50X65]
C43  33p  [CAPC100X50X65]
C44  33p  [CAPC100X50X65]
C45  100n  [CAPC100X50X65]
C46  100n  [CAPC100X50X65]
FB1  BLM18RK121SN1D  [BEADC1608X95N]  (value not drawn)
FB2  BLM18RK121SN1D  [BEADC1608X95N]  (value not drawn)
FB3  BLM18RK121SN1D  [BEADC1608X95N]  (value not drawn)
FB4  BLM18BD252SN1D  [BEADC1608X95N]  (value not drawn)
FB5  BLM18BD252SN1D  [BEADC1608X95N]  (value not drawn)
J6  CONN_S2B-PH-K-S(LF)(SN)  [JST_S2B-PH-K-S(LF)(SN)]  (value not drawn)
R42  0R  [RESC0402]
R43  0R  [RESC0402]
R44  0R  [RESC0402]
R45  0R  [RESC0402]
R46  0R  [RESC0402]
R47  0R  [RESC0402]
R48  0R  [RESC0402]
TP22  Test Point  [tp_1mm]  (value not drawn)  (no BOM)
U6  WM8960CGEFL  [CIRRUS_LOGIC_WM8960CGEFL-V_0]
U7  CMM-3722AT-42116-TR  [XDCR_CMM-3722AT-42116-TR]
U8  CMM-3722AT-42116-TR  [XDCR_CMM-3722AT-42116-TR]
Y1  24Mhz  [OSC_SG-210STF 24.0000ML0]

### Blocks framed on the sheet
Audio Codec: C25-C35 FB1 J6 R42-R48 TP22 U6
Place Close to IC: C36 C37 FB2 FB3
Microphones: C39-C46 FB4 FB5 U7 U8
MCLK OSCILATOR: C38 Y1

### Ports
I2C1_SCL (in), I2C1_SDA (bidir), I2S_ADC (out), I2S_BCLK (in), I2S_DAC (in), I2S_LRCLK (in)

### Nets
AVDD_3V3: C26.1 C29.1 C32.2 FB1.2 TP22.1 U6.32(AVDD)
GND: C25.2 C26.2 C27.1 C28.1 C29.2 C30.2 C31.2 C32.1 C33.1 C34.1 C35.1 C36.2 C37.2 C38.2 C41.1 C42.1 C43.1 C44.1 C45.2 C46.2 U6.9(DGND) U6.20(SPKGND2) U6.24(SPKGND1) U6.28(AGND) U6.33(GND_EP) U7.2(GND) U7.3(GND) U8.2(GND) U8.3(GND) Y1.2(Gnd)
MIC_BIAS: C28.2 U6.1(MICBIAS)
VDD_3V3: C25.1 C30.1 C31.1 C33.2 C38.1 C45.1 C46.1 FB1.1 U6.8(DCVDD) U6.10(DBVDD) U7.1(VDD) U8.1(VDD) Y1.1(En) Y1.4(Vdd)
VMID: C27.2 U6.27(VMID)
VREG_5V: C34.2 C35.2 U6.21(SPKVDD2) U6.26(SPKVDD1)
CODEC_ADC: R45.2 U6.16(ADCDAT)
CODEC_BCLK: R43.2 U6.12(BCLK)
CODEC_DAC: R44.2 U6.14(DACDAT)
CODEC_LRCLK: R46.2 U6.13(DACLRC) U6.15(ADCLRC/GPIO1)
CODEC_MCLK: R42.2 U6.11(MCLK)
I2C1_SCL: R47.1 ; port I2C1_SCL
I2C1_SDA: R48.1 ; port I2C1_SDA
I2S_ADC: R45.1 ; port I2S_ADC
I2S_BCLK: R43.1 ; port I2S_BCLK
I2S_DAC: R44.1 ; port I2S_DAC
I2S_LRCLK: R46.1 ; port I2S_LRCLK
I2S_MCLK: R42.1 Y1.3(Out)
MIC_L: C39.2 U6.4(LINPUT1)
MIC_R: C40.2 U6.5(RINPUT1)
NetC36_1: C36.1 FB3.2 J6.2
NetC37_1: C37.1 FB2.2 J6.1
NetC39_1: C39.1 C42.2 FB4.2
NetC40_1: C40.1 C44.2 FB5.2
NetC41_2: C41.2 FB4.1 U7.4(OUTPUT)
NetC43_2: C43.2 FB5.1 U8.4(OUTPUT)
NetFB2_1: FB2.1 U6.19(SPK_RN)
NetFB3_1: FB3.1 U6.22(SPK_RP)
NetR47_2: R47.2 U6.17(SCLK)
NetR48_2: R48.2 U6.18(SDA)

Not connected (* = marked no-connect by the designer): U6 2(LINPUT3/JD2) 3(LINPUT2) 6(RINPUT2) 7(RINPUT3/JD3) 23(SPK_LN) 25(SPK_LP) 29(HP_R) 30(OUT3) 31(HP_L)

### Notes on the sheet
- Title
- Size:
- Date:
- A4
- Number:
- Revision:
- Sheet
- of
- FISHWAND
- File:
- Drawn By:

### Library data of the parts
C25 C39 C40 = C_10UF_10V_X5R_0402: as C66 on sheet 01 - rpiInterface; Supplier PN: 1276-1450-1-ND
C26 C29-C31 C38 C45 C46 = C_100NF_25V_X5R_0402: as C1 on sheet 01 - rpiInterface; Supplier: Digi-Key; Supplier PN: 490-5920-2-ND
C27 C28 C32-C35 = C_4.7UF_10V_X5R_0402: as C12 on sheet 02 - Power; Supplier PN: 490-14306-1-ND
C36 C37 = C_100PF_50V_C0G/NP0_0402: CAP CER 100PF 50V C0G/NP0 0402; Manufacturer: Murata Electronics; Manufacturer PN: GRT1555C1H101JA02J; Supplier: Digi-Key; Supplier PN: 490-GRT1555C1H101JA02JTR-ND
C41-C44 = C_33PF_50V_X5R_0402: CAP CER 33PF 50V C0G/NP0 0402; Manufacturer: Murata Electronics; Manufacturer PN: GRM1555C1H330JA01D; Supplier: Digi-Key; Supplier PN: 490-5936-2-ND
FB1-FB3 = FB_0603_120_100MHz: 120 Ohms @ 100 MHz 1 Ferrite Bead 0603 (1608 Metric) 200mA 250mOhm; Manufacturer: Murata Electronics; Value: 120@100MHz; Manufacturer PN: BLM18RK121SN1D; Supplier: Digi-Key; Supplier PN: 490-5226-1-ND; Package / Case: 0603; Current: 200mA; test: *
FB4 FB5 = FB_0603_2.5K_100MHz: 2.5 kOhms @ 100 MHz 1 Signal Line Ferrite Bead 0603 (1608 Metric) 50mA 1.5Ohm; Manufacturer: Murata Electronics; Value: 2.5k@100MHz; Manufacturer PN: BLM18BD252SN1D; Supplier: *; Supplier PN: *; Package / Case: 0603
J6 = CONN_S2B-PH-K-S(LF)(SN): CONN PH Series 2 Position 2.0 mm Through Hole Side Entry Shrouded Header; Manufacturer: JST; Availability: Unavailable; Value: *; Manufacturer PN: S2B-PH-K-S(LF)(SN); Price: None; Package / Case: None
R42-R48 = R_0402_0R_5%: as R5 on sheet 01 - rpiInterface; Supplier: *; Supplier PN: *; Value: 0R; Package / Case: 0402
TP22 = TP_1mm
U6 = CIRRUS_LOGIC_U_WM8960CGEFL-VCIRRUS_LOGIC_WM8960CGEFL-V_0_0: Manufacturer: Cirrus Logic; Manufacturer PN: WM8960CGEFL/V; Package / Case: QFN32
U7 U8 = CMM-3722AT-42116-TR: MICROPHONE MEMS ANALOG OMNI; Manufacturer: CUI Devices; Price: 1.33; Value: *; Availability: Unavailable; Package / Case: SMD/SMT; Manufacturer PN: CMM-3722AT-42116-TR; Supplier: Mouser; Supplier PN: 490-CMM3722AT42116TR
Y1 = Y_24Mhz_Crystal_SG-210STF 24.0000ML0: 24 MHz XO (Standard) CMOS Oscillator 1.6V ~ 3.6V Standby (Power Down) 4-SMD, No Lead; Manufacturer: EPSON; Value: *; Manufacturer PN: SG-210STF 24.0000ML0; Price: None; Supplier: Digi-Key; Supplier PN: SER4078TR-ND; Package / Case: 4-SMD, No Lead

## Sheet 03 - IMU.SchDoc: IMU
size A4; DrawnBy: Trevor Charmley; DocumentNumber: 5; Revision: 1; SheetNumber: 5; SheetTotal: 8
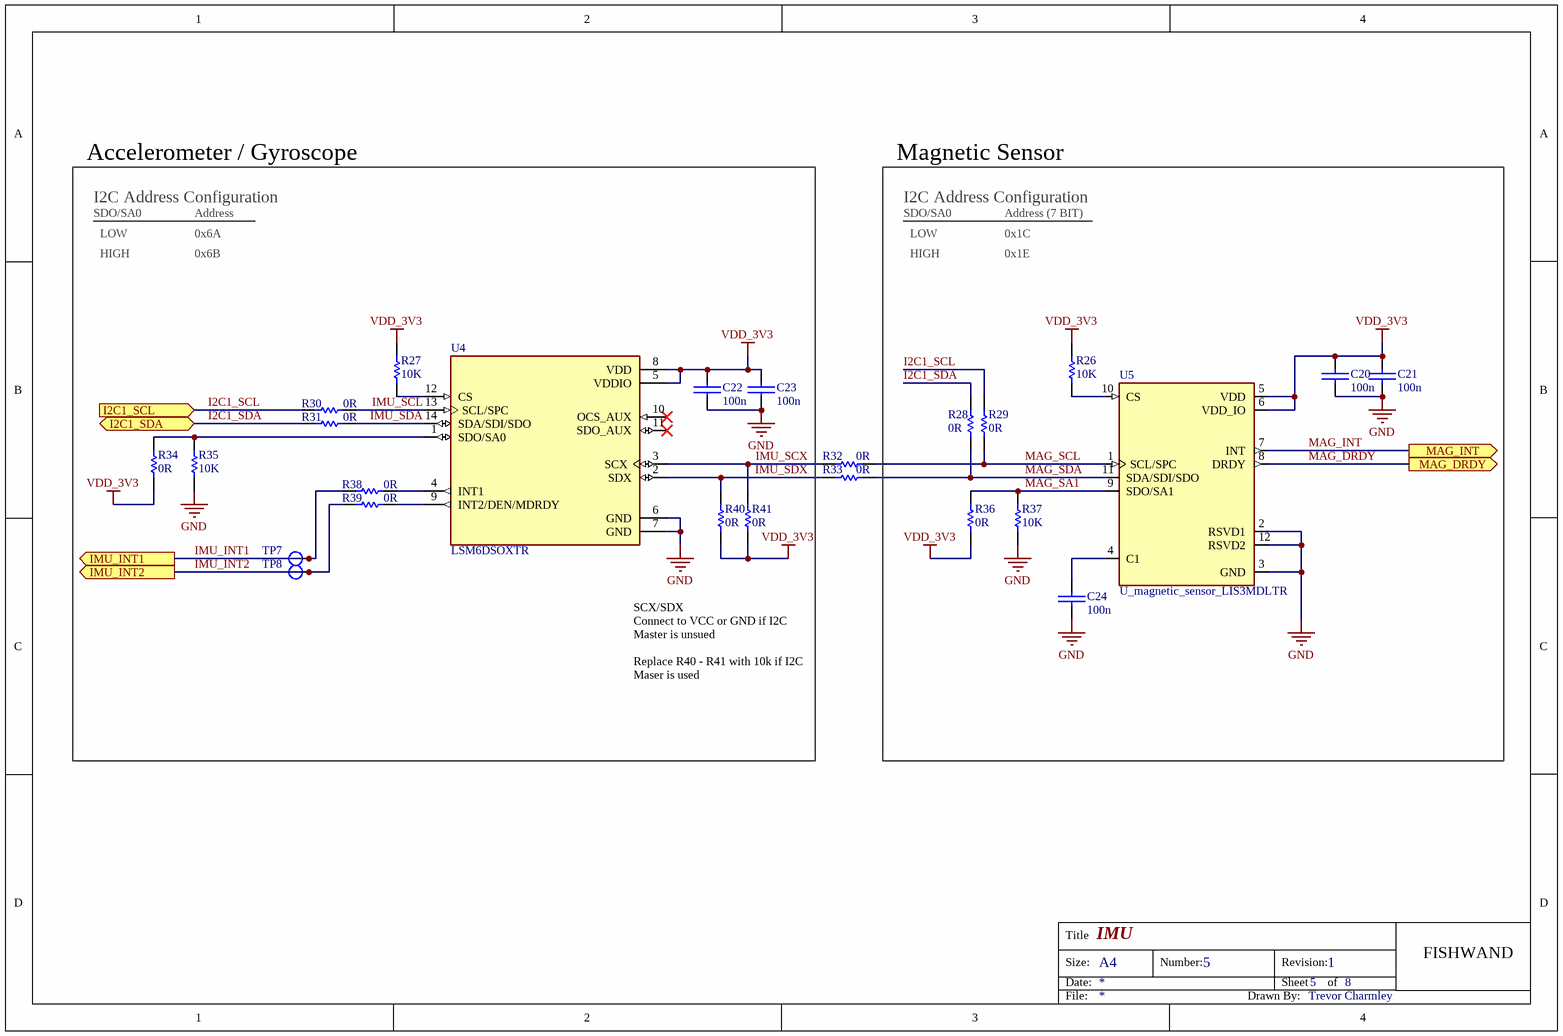
[diagram p4: 03 - IMU.SchDoc]

### Parts
C20  100n  [CAPC100X50X65]
C21  100n  [CAPC100X50X65]
C22  100n  [CAPC100X50X65]
C23  100n  [CAPC100X50X65]
C24  100n  [CAPC100X50X65]
R26  10K  [RESC0402]
R27  10K  [RESC0402]
R28  0R  [RESC0402]
R29  0R  [RESC0402]
R30  0R  [RESC0402]
R31  0R  [RESC0402]
R32  0R  [RESC0402]
R33  0R  [RESC0402]
R34  0R  [RESC0402]
R35  10K  [RESC0402]
R36  0R  [RESC0402]
R37  10K  [RESC0402]
R38  0R  [RESC0402]
R39  0R  [RESC0402]
R40  0R  [RESC0402]
R41  0R  [RESC0402]
TP7  Test Point  [tp_1mm]  (value not drawn)  (no BOM)
TP8  Test Point  [tp_1mm]  (value not drawn)  (no BOM)
U4  LSM6DSOXTR  [PQFN50P300X250X86-14N]
U5  U_magnetic_sensor_LIS3MDLTR  [XDCR_LIS3MDLTR]

### Blocks framed on the sheet
Accelerometer / Gyroscope: C22 C23 R27 R30 R31 R34 R35 R38-R41 TP7 TP8 U4
Magnetic Sensor: C20 C21 C24 R26 R28 R29 R36 R37 U5

### Ports
I2C1_SCL (in), I2C1_SDA (bidir), IMU_INT1 (out), IMU_INT2 (out), MAG_DRDY (out), MAG_INT (out)

### Nets
GND: C20.2 C21.2 C22.2 C23.2 C24.2 R35.1 R37.1 U4.6(GND) U4.7(GND) U5.2(RSVD1) U5.3(GND) U5.12(RSVD2)
VDD_3V3: C20.1 C21.1 C22.1 C23.1 R26.2 R27.2 R34.1 R36.1 R40.1 R41.1 U4.5(VDDIO) U4.8(VDD) U5.5(VDD) U5.6(VDD_IO)
I2C1_SCL: R29.1 R30.1 ; port I2C1_SCL
I2C1_SDA: R28.1 R31.1 ; port I2C1_SDA
IMU_INT1: R38.1 TP7.1 ; port IMU_INT1
IMU_INT2: R39.1 TP8.1 ; port IMU_INT2
IMU_SCL: R30.2 U4.13(SCL/SPC)
IMU_SCX: R32.2 R41.2 U4.3(SCX)
IMU_SDA: R31.2 U4.14(SDA/SDI/SDO)
IMU_SDX: R33.2 R40.2 U4.2(SDX)
MAG_DRDY: U5.8(DRDY) ; port MAG_DRDY
MAG_INT: U5.7(INT) ; port MAG_INT
MAG_SA1: R36.2 R37.2 U5.9(SDO/SA1)
MAG_SCL: R29.2 R32.1 U5.1(SCL/SPC)
MAG_SDA: R28.2 R33.1 U5.11(SDA/SDI/SDO)
NetC24_1: C24.1 U5.4(C1)
NetR26_1: R26.1 U5.10(CS)
NetR27_1: R27.1 U4.12(CS)
NetR34_2: R34.2 R35.2 U4.1(SDO/SA0)
NetR38_2: R38.2 U4.4(INT1)
NetR39_2: R39.2 U4.9(INT2/DEN/MDRDY)

Not connected (* = marked no-connect by the designer): U4 10(OCS_AUX)* 11(SDO_AUX)*

### Notes on the sheet
- I2C Address Configuration
- SDO/SA0
- LOW
- 0x6A
- Address
- 0x1C
- Address (7 BIT)
- HIGH
- 0x6B
- 0x1E
- SCX/SDX
  Connect to VCC or GND if I2C Master is unsued
  Replace R40 - R41 with 10k if I2C Maser is used
- Title
- Size:
- Date:
- A4
- Number:
- Revision:
- Sheet
- of
- FISHWAND
- File:
- Drawn By:

### Library data of the parts
C20-C24 = C_100NF_25V_X5R_0402: as C1 on sheet 01 - rpiInterface; Supplier: Digi-Key; Supplier PN: 490-5920-2-ND
R26 R27 R35 R37 = R_0402_10K_1%: as R1 on sheet 01 - rpiInterface; Supplier: *; Supplier PN: *; Value: 10K; Tolerance: 1%; Package / Case: 0402
R28-R34 R36 R38-R41 = R_0402_0R_5%: as R5 on sheet 01 - rpiInterface; Supplier: *; Supplier PN: *; Value: 0R; Package / Case: 0402
TP7 TP8 = TP_1mm
U4 = U_LSM6DSOXTR: Accelerometer, Gyroscope, Temperature, 6 Axis Sensor IÂ²C, SPI Output; Manufacturer: STMicroelectronics; Value: *; Availability: Unavailable; SnapEDA_Link: https://www.snapeda.com/parts/LSM6DSMTR/STMicroelectronics/view-part/581716/?ref=snap; Package / Case: 14-VFLGA Module; Manufacturer PN: LSM6DSOXTR; Price: None; Supplier: Digi-Key; Supplier PN: 497-18367-2-ND
U5 = U_magnetic_sensor_LIS3MDLTR: Magnetoresistive Sensor X, Y, Z Axis 12-LGA _2x2_; Manufacturer: STMicroelectronics; Availability: Unavailable; Price: None; SnapEDA_Link: https://www.snapeda.com/parts/LIS3MDLTR/STMicroelectronics/view-part/382740/?ref=snap; Package / Case: VFLGA-12 STMicroelectronics; Value: *; Manufacturer PN: LIS3MDLTR; Supplier: Digi-Key; Supplier PN: 497-13892-1-ND

## Sheet 05-usb-Debugger.SchDoc: USB to Uart Bridge
size A4; DrawnBy: Trevor Charmley; Engineer: Trevor Charmley; DocumentNumber: 7; Revision: 1; SheetNumber: 7; SheetTotal: 8
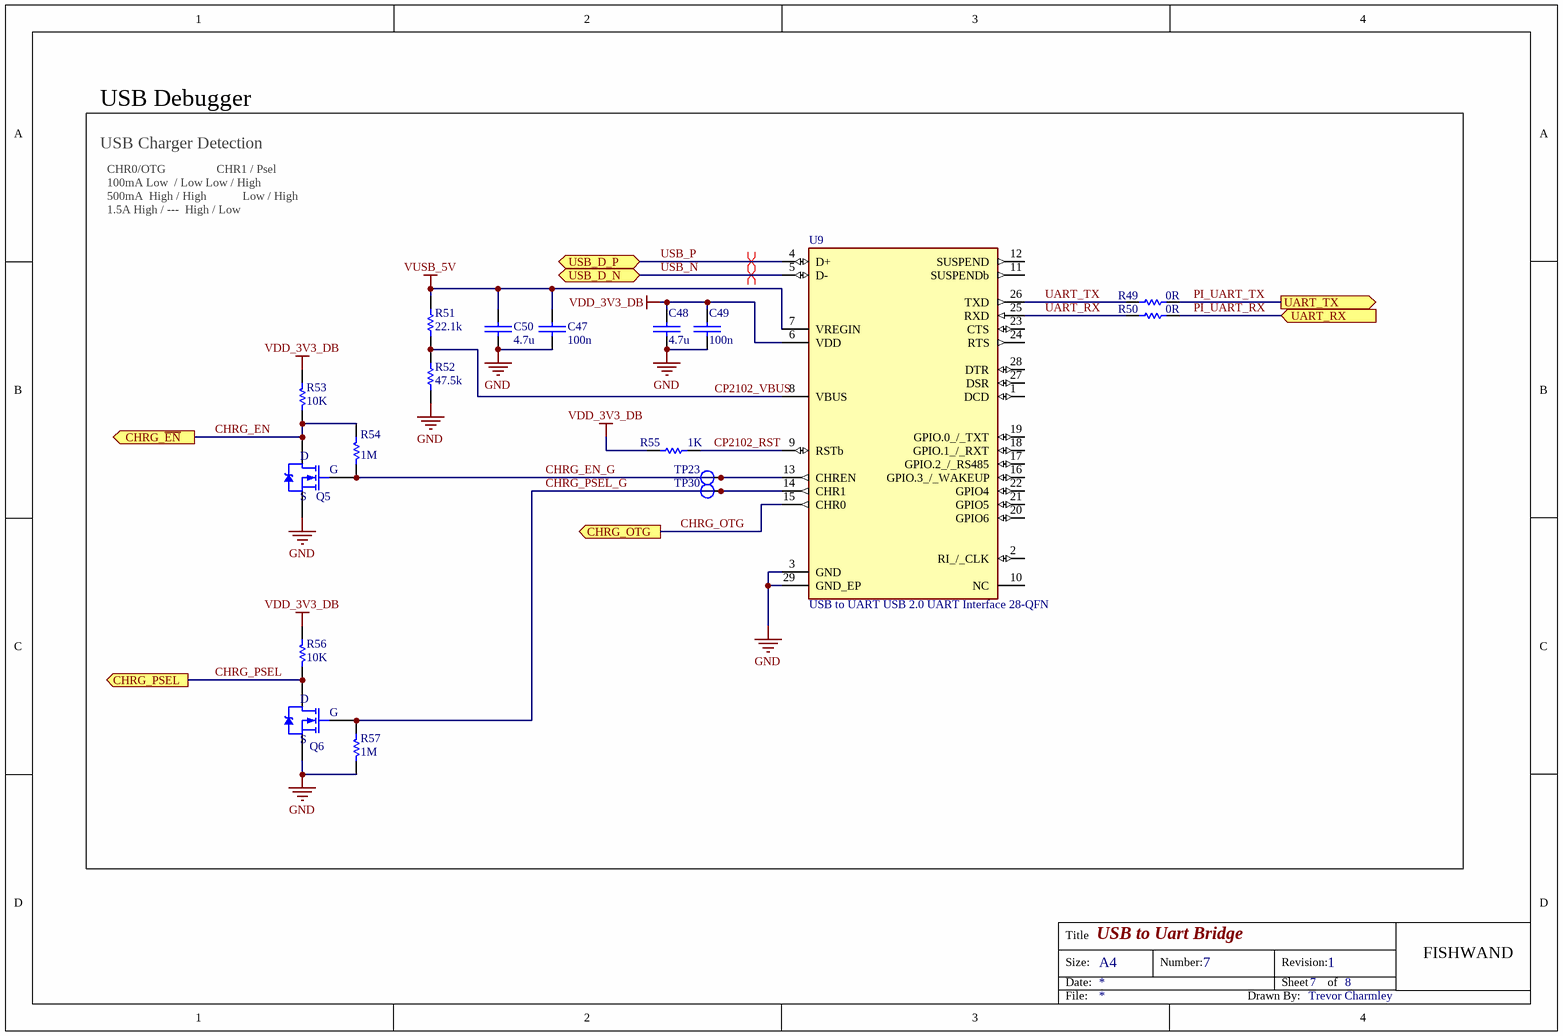
[diagram p5: 05-usb-Debugger.SchDoc]

### Parts
C47  100n  [CAPC100X50X65]
C48  4.7u  [CAPC100X50X65]
C49  100n  [CAPC100X50X65]
C50  4.7u  [CAPC100X50X65]
Q5  BSS138LT1G  [SOT23-3P95_240X111L42X43N]  (value not drawn)
Q6  BSS138LT1G  [SOT23-3P95_240X111L42X43N]  (value not drawn)
R49  0R  [RESC0402]
R50  0R  [RESC0402]
R51  22.1k  [RESC0402]
R52  47.5k  [RESC0402]  (net tie)
R53  10K  [RESC0402]
R54  1M  [RESC0402]
R55  1K  [RESC0402]
R56  10K  [RESC0402]
R57  1M  [RESC0402]
TP23  Test Point  [tp_1mm]  (value not drawn)  (no BOM)
TP30  Test Point  [tp_1mm]  (value not drawn)  (no BOM)
U9  USB to UART USB 2.0 UART Interface 28-QFN  [QFN50P500X500X80-29N]

### Ports
CHRG_OTG (out), CHRG_PSEL (out), CHRG_~{EN} (out), UART_RX (in), UART_TX (out), USB_D_N, USB_D_P

### Nets
GND: C47.2 C48.2 C49.2 C50.2 Q5.2(S) Q6.2(S) R52.1 R57.1 U9.3(GND) U9.29(GND_EP)
VDD_3V3_DB: C48.1 C49.1 R53.2 R55.1 R56.2 U9.6(VDD)
VUSB_5V: C47.1 C50.1 R51.2 U9.7(VREGIN)
CHRG_EN: Q5.3(D) R53.1 R54.2 ; port CHRG_~{EN}
CHRG_EN_G: Q5.1(G) R54.1 TP23.1 U9.13(CHREN)
CHRG_OTG: U9.15(CHR0) ; port CHRG_OTG
CHRG_PSEL: Q6.3(D) R56.1 ; port CHRG_PSEL
CHRG_PSEL_G: Q6.1(G) R57.2 TP30.1 U9.14(CHR1)
CP2102_RST: R55.2 U9.9(RSTb)
CP2102_VBUS: R51.1 R52.2 U9.8(VBUS)
PI_UART_RX: R50.2 ; port UART_RX
PI_UART_TX: R49.2 ; port UART_TX
UART_RX: R50.1 U9.25(RXD)
UART_TX: R49.1 U9.26(TXD)
USB_N: U9.5(D-) ; port USB_D_N
USB_P: U9.4(D+) ; port USB_D_P

Not connected (* = marked no-connect by the designer): U9 1(DCD) 2(RI_/_CLK) 10(NC) 11(SUSPENDb) 12(SUSPEND) 16(GPIO.3_/_WAKEUP) 17(GPIO.2_/_RS485) 18(GPIO.1_/_RXT) 19(GPIO.0_/_TXT) 20(GPIO6) 21(GPIO5) 22(GPIO4) 23(CTS) 24(RTS) 27(DSR) 28(DTR)

### Layout directives
differential pair: USB_N, USB_P

### Notes on the sheet
- USB Debugger
- USB Charger Detection
- CHR0/OTG	                CHR1 / Psel
  100mA	Low  / Low	Low / High
  500mA 	High / High           	Low / High
  1.5A	High / ---		High / Low
- Title
- Size:
- Date:
- A4
- Number:
- Revision:
- Sheet
- of
- FISHWAND
- File:
- Drawn By:

### Library data of the parts
C47 C49 = C_100NF_25V_X5R_0402: as C1 on sheet 01 - rpiInterface; Supplier: Digi-Key; Supplier PN: 490-5920-2-ND
C48 C50 = C_4.7UF_10V_X5R_0402: as C12 on sheet 02 - Power; Supplier PN: 490-14306-1-ND
Q5 Q6 = TRANS_MOSFET_N_50V_200MA_SOT23: as Q1 on sheet 01 - rpiInterface; Manufacturer PN: BSS138LT1G; Type: MOSFET N-CH; Supplier PN: BSS138LT1GOSCT-ND
R49 R50 = R_0402_0R_5%: as R5 on sheet 01 - rpiInterface; Supplier: *; Supplier PN: *; Value: 0R; Package / Case: 0402
R51 = RC0402FR-0722K1L: 22.1 kOhms ±1% 0.063W, 1/16W Chip Resistor 0402 (1005 Metric) Moisture Resistant Thick Film; Manufacturer: YAGEO; Value: 22K1; Manufacturer PN: RC0402FR-0722K1L; Supplier: *; Supplier PN: *; Tolerance: 1%; Package / Case: 0402
R52 = RC0402FR-0747K5L: 47.5 kOhms ±1% 0.063W, 1/16W Chip Resistor 0402 (1005 Metric) Moisture Resistant Thick Film; Manufacturer: YAGEO; Manufacturer PN: RC0402FR-0747K5L; Supplier: *; Supplier PN: *; Value: 47.5k; Tolerance: 1%; Package / Case: 0402
R53 R56 = R_0402_10K_1%: as R1 on sheet 01 - rpiInterface; Supplier: *; Supplier PN: *; Value: 10K; Tolerance: 1%; Package / Case: 0402
R54 R57 = R_0402_1M_1%: as R3 on sheet 01 - rpiInterface; Supplier: Digi-Key; Supplier PN: 311-1.00MLRTR-ND; Value: 1M; Tolerance: 1%; Package / Case: 0402
R55 = RC0402FR-071KL: 1 kOhms ±1% 0.063W, 1/16W Chip Resistor 0402 (1005 Metric) Moisture Resistant Thick Film; Manufacturer: YAGEO; Value: 0R; Tolerance: 5%; Manufacturer PN: RC0402FR-071KL; Supplier: *; Supplier PN: *; Package / Case: 0402
TP23 TP30 = TP_1mm
U9 = USB to UART USB 2.0 UART Interface 28-QFN: USB Bridge, USB to UART USB 2.0 UART Interface 28-QFN (5x5); Manufacturer: Silicon Labs; Manufacturer PN: CP2102N-A02-GQFN28; Value: *; Price: None; Mouser-Purchase-URL: https://www.mouser.com/ProductDetail/Silicon-Labs/CP2102N-A02-GQFN28?qs=u16ybLDytRaSBkSkyjYFiA%3D%3D; Supplier: Mouser; Supplier PN: 634-CP2102NA02GQFN28; Package / Case: QFN-28

## Sheet 06- NFC.SchDoc: NFC
size A4; DrawnBy: Trevor Charmley; DocumentNumber: 8; Revision: 1; SheetNumber: 8; SheetTotal: 8
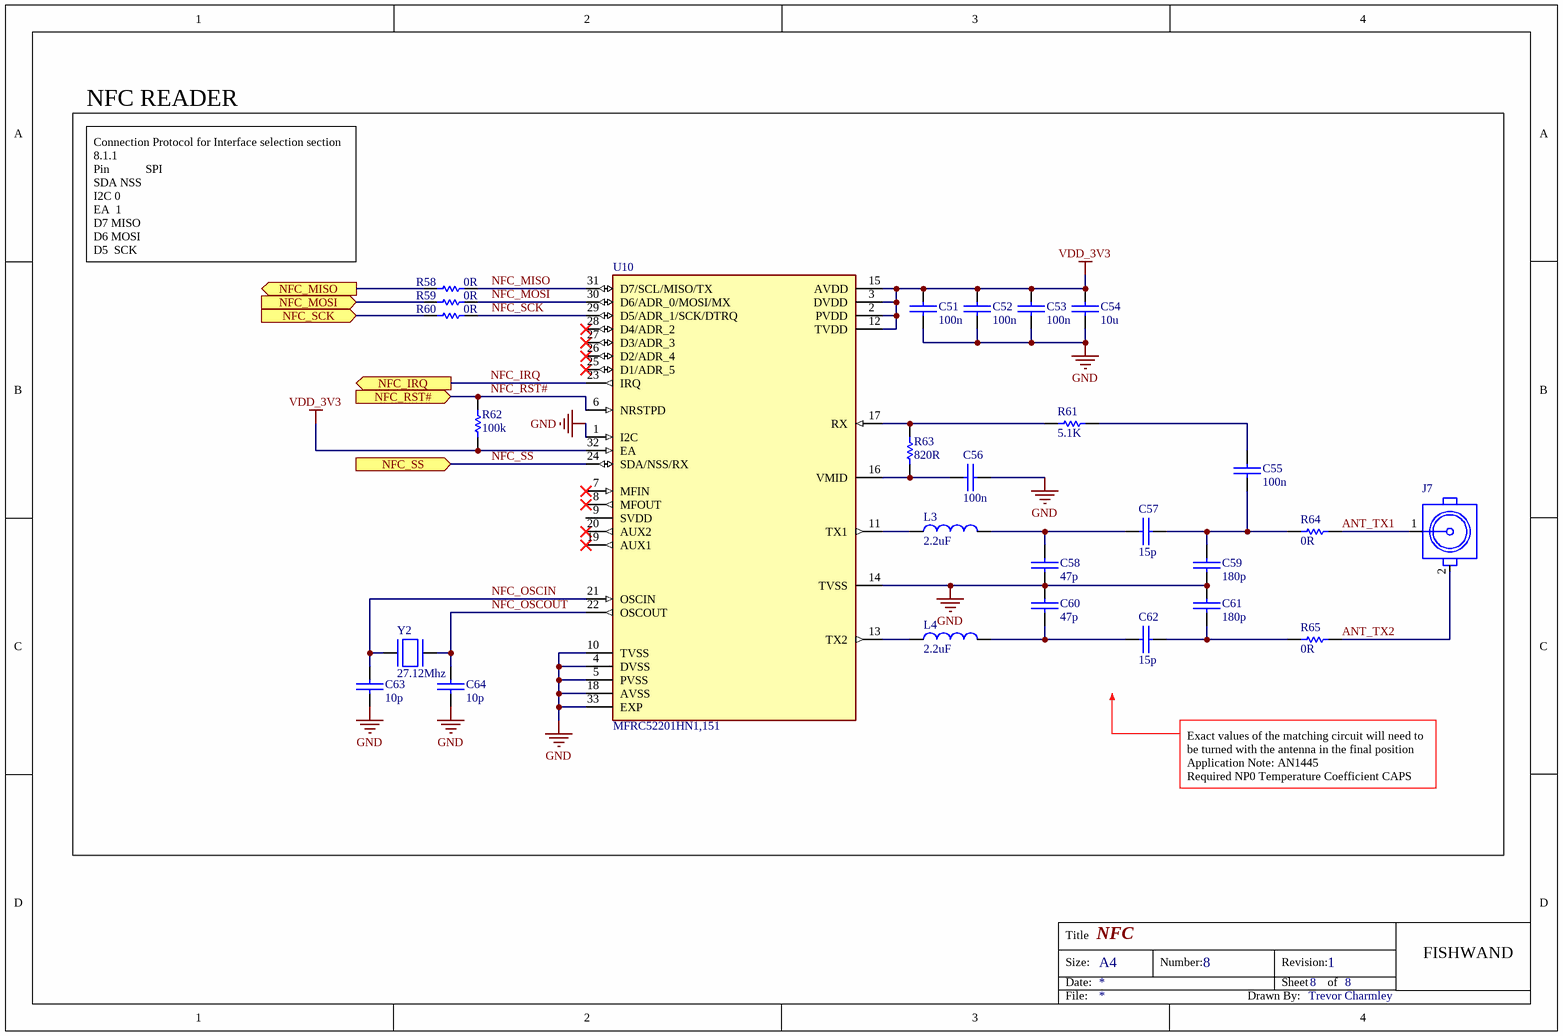
[diagram p6: 06- NFC.SchDoc]

### Parts
C51  100n  [CAPC100X50X65]
C52  100n  [CAPC100X50X65]
C53  100n  [CAPC100X50X65]
C54  10u  [CAPC100X50X65]
C55  100n  [CAPC100X50X65]
C56  100n  [CAPC100X50X65]
C57  15p  [CAPC100X50X65]
C58  47p  [CAPC100X50X65]
C59  180p  [CAPC100X50X65]
C60  47p  [CAPC100X50X65]
C61  180p  [CAPC100X50X65]
C62  15p  [CAPC100X50X65]
C63  10p  [CAPC100X50X65]
C64  10p  [CAPC100X50X65]
J7  RF20-01B-L-00-50-G-T/R  [MCX_SMT_RF20-01B-L-00-50-G-T/R]  (value not drawn)
L3  2.2uF  [INDC2016X180N]
L4  2.2uF  [INDC2016X180N]
R58  0R  [RESC0402]
R59  0R  [RESC0402]
R60  0R  [RESC0402]
R61  5.1K  [RESC0402]
R62  100k  [RESC0402]
R63  820R  [RESC0402]
R64  0R  [RESC0402]
R65  0R  [RESC0402]
U10  MFRC52201HN1,151  [QFN50P500X500X100-33N]
Y2  27.12Mhz  [OSC_XRCGB27M120F3M00R0]

### Blocks framed on the sheet
NFC READER: C51-C64 J7 L3 L4 R58-R65 U10 Y2

### Ports
NFC_IRQ (out), NFC_MISO (out), NFC_MOSI (in), NFC_RST# (in), NFC_SCK (in), NFC_SS (in)

### Nets
GND: C51.2 C52.2 C53.2 C54.2 C56.2 C58.2 C59.2 C60.1 C61.1 C63.2 C64.2 U10.1(I2C) U10.4(DVSS) U10.5(PVSS) U10.10(TVSS) U10.14(TVSS) U10.18(AVSS) U10.33(EXP)
VDD_3V3: C51.1 C52.1 C53.1 C54.1 R62.1 U10.2(PVDD) U10.3(DVDD) U10.12(TVDD) U10.15(AVDD) U10.32(EA)
ANT_TX1: J7.1 R64.2
ANT_TX2: J7.2 R65.2
NFC_IRQ: U10.23(IRQ) ; port NFC_IRQ
NFC_MISO: R58.2 U10.31(D7/SCL/MISO/TX)
NFC_MOSI: R59.2 U10.30(D6/ADR_0/MOSI/MX)
NFC_OSCIN: C63.1 U10.21(OSCIN) Y2.1
NFC_OSCOUT: C64.1 U10.22(OSCOUT) Y2.3
NFC_RST#: R62.2 U10.6(NRSTPD) ; port NFC_RST#
NFC_SCK: R60.2 U10.29(D5/ADR_1/SCK/DTRQ)
NFC_SS: U10.24(SDA/NSS/RX) ; port NFC_SS
SPI_MISO: R58.1 ; port NFC_MISO
SPI_MOSI: R59.1 ; port NFC_MOSI
SPI_SCK: R60.1 ; port NFC_SCK
NetC55_1: C55.1 R61.2
NetC55_2: C55.2 C57.2 C59.1 R64.1
NetC56_1: C56.1 R63.1 U10.16(VMID)
NetC57_1: C57.1 C58.1 L3.2
NetC60_2: C60.2 C62.1 L4.2
NetC61_2: C61.2 C62.2 R65.1
NetL3_1: L3.1 U10.11(TX1)
NetL4_1: L4.1 U10.13(TX2)
NetR61_1: R61.1 R63.2 U10.17(RX)

Not connected (* = marked no-connect by the designer): U10 7(MFIN)* 8(MFOUT)* 9(SVDD) 19(AUX1)* 20(AUX2)* 25(D1/ADR_5)* 26(D2/ADR_4)* 27(D3/ADR_3)* 28(D4/ADR_2)*

### Notes on the sheet
- Connection Protocol for Interface selection section 8.1.1
  Pin            SPI
  SDA	NSS
  I2C	0
  EA 	1
  D7	MISO
  D6	MOSI
  D5 	SCK
- Exact values of the matching circuit will need to be turned with the antenna in the final position
  Application Note: AN1445
  Required NP0 Temperature Coefficient CAPS
- Title
- Size:
- Date:
- A4
- Number:
- Revision:
- Sheet
- of
- FISHWAND
- File:
- Drawn By:

### Library data of the parts
C51-C53 C55 C56 = C_100NF_25V_X5R_0402: as C1 on sheet 01 - rpiInterface; Supplier: Digi-Key; Supplier PN: 490-5920-2-ND
C54 = C_10UF_10V_X5R_0402: as C66 on sheet 01 - rpiInterface; Supplier PN: 1276-1450-1-ND
C57 C62 = C_15pF_0402_NP0_2%: 15 pF ±2% 50V Ceramic Capacitor C0G, NP0 0402 (1005 Metric); Manufacturer: YAGEO; Manufacturer PN: CC0402GRNPO9BN150; Value: 15pF; Supplier: Digi-Key; Supplier PN: 311-1649-1-ND; Tolerance: 2%
C58 C60 = C_47pF_0402_NP0_1%: 47 pF ±1% 50V Ceramic Capacitor C0G, NP0 0402 (1005 Metric); Manufacturer: YAGEO; Manufacturer PN: CC0402FRNPO9BN470; Value: 47pF; Supplier: Digi-Key; Supplier PN: 311-1646-1-ND; Tolerance: 1%
C59 C61 = C_180pF_0402_NP0_2%: 180 pF ±2% 50V Ceramic Capacitor C0G, NP0 0402 (1005 Metric); Manufacturer: YAGEO; Manufacturer PN: CC0402GRNPO9BN181; Value: 180pF; Supplier: Digi-Key; Supplier PN: 311-3333-1-ND; Tolerance: 2%
C63 C64 = C_10PF_50V_C0G/NP0_0402: CAP CER 10PF 50V C0G/NP0 0402; Manufacturer: Murata Electronics; Manufacturer PN: GRT1555C1H100JA02J; Supplier: Digi-Key; Supplier PN: 490-GRT1555C1H100JA02JTR-ND
J7 = CONN_RF_MCX_F20-01B-L-00-50-G-T/R: CONN RF MCX SMT VERT 50OHM; Manufacturer: Adam Tech; Manufacturer PN: RF20-01B-L-00-50-G-T/R; Supplier PN: 2057-RF20-01B-L-00-50-G-T/RCT-ND; Package / Case: MCX SMT VERT 50OHM; Supplier: Digi-Key
L3 L4 = L_LBM2016T2R2J_0805: 2.2 µH Unshielded Drum Core, Wirewound Inductor 340 mA 540mOhm 0806 (2016 Metric); Manufacturer: Taiyo Yuden; Value: *; SnapEDA_Link: https://www.snapeda.com/parts/LBM2016T2R2J/Taiyo%20Yuden/view-part/1510952/?ref=snap; Package / Case: 0805; Manufacturer PN: LBM2016T2R2J; Price: None; Availability: Unavailable; Supplier: Digi-Key; Supplier PN: 587-1807-1-ND
R58-R60 R64 R65 = R_0402_0R_5%: as R5 on sheet 01 - rpiInterface; Supplier: *; Supplier PN: *; Value: 0R; Package / Case: 0402
R61 = R_0402_5.1K_1%: 5.1 kOhms ±1% 0.063W, 1/16W Chip Resistor 0402 (1005 Metric) Moisture Resistant Thick Film; Manufacturer: YAGEO; Manufacturer PN: RC0402FR-075K1L; Supplier: Digi-Key; Supplier PN: 311-5.10KLRTR-ND; Value: 5.1K; Tolerance: 1%; Package / Case: 0402
R62 = R_0402_100k_1%: as R18 on sheet 02 - Power; Supplier: Digi-Key; Supplier PN: 311-100KLRTR-ND; Value: 100k; Tolerance: 1%; Package / Case: 0402
R63 = R_0402_820R_1%: 820 Ohms ±1% 0.063W, 1/16W Chip Resistor 0402 (1005 Metric) Moisture Resistant Thick Film; Manufacturer: YAGEO; Manufacturer PN: RC0402FR-07820RL; Supplier: Digi-Key; Supplier PN: 311-820LRCT-ND; Value: 820R; Tolerance: 1%; Package / Case: 0402
U10 = MFRC52201HN1,151: RFID Reader IC 13.56MHz ISO 14443, MIFARE IÂ²C, SPI, UART 2.5V ~ 3.3V 32-VFQFN Exposed Pad; Manufacturer: NXP USA; Value: *; SnapEDA_Link: https://www.snapeda.com/parts/MFRC52201HN1%2C151/NXP%20USA%20Inc./view-part/480321/?ref=snap; Availability: Unavailable; Price: None; Package / Case: HVQFN-32; Manufacturer PN: MFRC52201HN1,151; Supplier: *
Y2 = Y_27.12Mhz_Crystal_XRCGB27M120F3M00R0: 27.12MHz Â±30ppm Crystal 6pF 150 Ohms 4-SMD, No Lead; Manufacturer: Murata Electronics; Value: *; SnapEDA_Link: https://www.snapeda.com/parts/XRCGB27M120F3M00R0/Murata%20Electronics%20North%20America/view-part/108821/?ref=snap; Manufacturer PN: XRCGB27M120F3M00R0; Purchase-URL: https://pricing.snapeda.com/search/part/XRCGB27M120F3M00R0/?ref=eda; Check_prices: https://www.snapeda.com/parts/XRCGB27M120F3M00R0/Murata%20Electronics%20North%20America/view-part/108821/?ref=eda; Availability: Good; Price: None; Supplier: Mouser; Supplier PN: 81-XRCGB27M120F3M0R0; Package / Case: SMD-4 Murata

## Sheet CoverPage.SchDoc: Cover Page
size A4; DrawnBy: Trevor Charmley; DocumentNumber: 1; Revision: 1; SheetNumber: 1; SheetTotal: 8
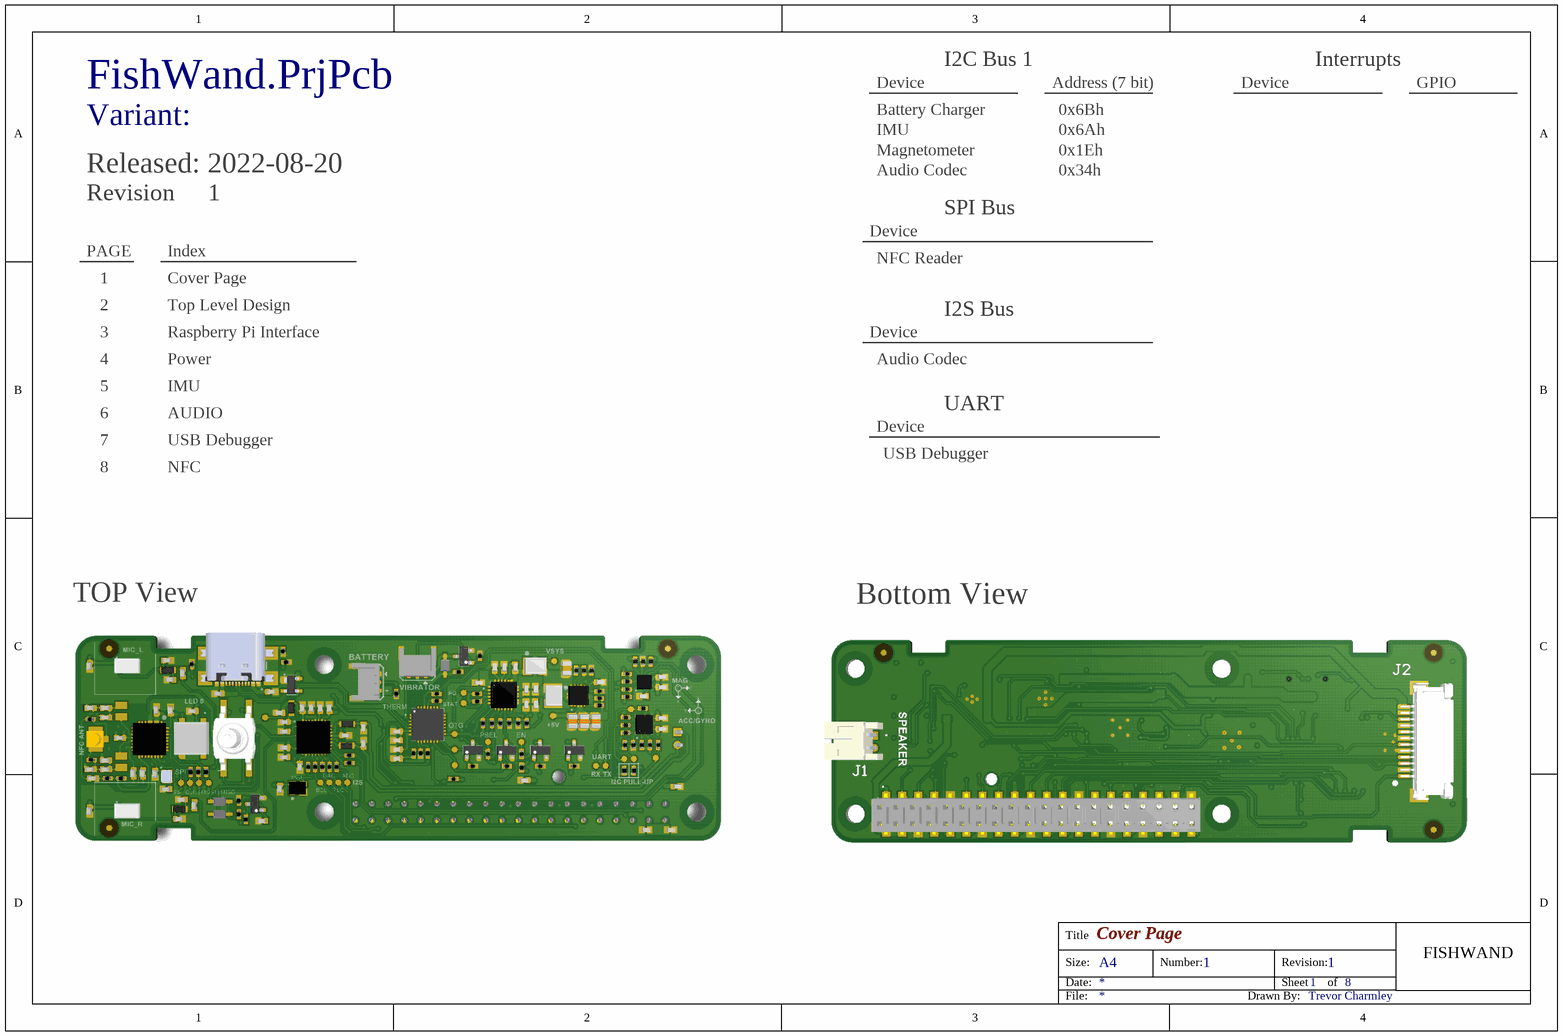
[diagram p7: CoverPage.SchDoc]

### Notes on the sheet
- Device
- Battery Charger
- I2C Bus 1
- Address (7 bit)
- 0x6Bh
- Interrupts
- GPIO
- Variant:
- Released: 2022-08-20
- IMU
- Magnetometer
- Audio Codec
- 0x6Ah
- 0x1Eh
- 0x34h
- Revision
- SPI Bus
- PAGE
- 1
- 2
- Index
- Cover Page
- Top Level Design
- NFC Reader
- 3
- 4
- Raspberry Pi Interface
- Power
- I2S Bus
- 5
- 6
- 7
- AUDIO
- USB Debugger
- UART
- 8
- NFC
- TOP View
- Bottom View
- Title
- Size:
- Date:
- A4
- Number:
- Revision:
- Sheet
- of
- FISHWAND
- File:
- Drawn By:

## Nets that join several sheets
GND: 01 - rpiInterface (28 pins), 02 - Power (36 pins), 04 - Audio (30 pins), 03 - IMU (12 pins), 05-usb-Debugger (10 pins), 06- NFC (18 pins)
VDD_3V3: 01 - rpiInterface (6 pins), 02 - Power (R11.2 R12.2 R14.2), 04 - Audio (14 pins), 03 - IMU (14 pins), 06- NFC (10 pins)
VDD_3V3_DB: 02 - Power (R13.2), 05-usb-Debugger (6 pins)
VREG_5V: 01 - rpiInterface (8 pins), 02 - Power (8 pins), 04 - Audio (C34.2 C35.2 U6.21 U6.26)
VUSB_5V: 02 - Power (8 pins), 05-usb-Debugger (C47.1 C50.1 R51.2 U9.7)
CHRG_EN: 02 - Power (R16.2 TP19.1 U2.9), 05-usb-Debugger (Q5.3 R53.1 R54.2)
CHRG_INT: 01 - rpiInterface (J1.29), 02 - Power (R14.1 U2.7)
CHRG_OTG: 02 - Power (R13.1 TP18.1 U2.8), 05-usb-Debugger (U9.15)
CHRG_PSEL: 02 - Power (TP20.1 U2.2), 05-usb-Debugger (Q6.3 R56.1)
I2C1_SCL: 00 - TitlePage (TP5.1), 01 - rpiInterface (J1.5 R2.1), 02 - Power (U2.5), 04 - Audio (R47.1), 03 - IMU (R29.1 R30.1)
I2C1_SDA: 00 - TitlePage (TP6.1), 01 - rpiInterface (J1.3 R1.1), 02 - Power (U2.6), 04 - Audio (R48.1), 03 - IMU (R28.1 R31.1)
I2S_ADC: 00 - TitlePage (TP2.1), 01 - rpiInterface (J1.38), 04 - Audio (R45.1)
I2S_BCLK: 00 - TitlePage (TP4.1), 01 - rpiInterface (J1.12), 04 - Audio (R43.1)
I2S_DAC: 00 - TitlePage (TP3.1), 01 - rpiInterface (J1.40), 04 - Audio (R44.1)
I2S_LRCLK: 00 - TitlePage (TP1.1), 01 - rpiInterface (J1.35), 04 - Audio (R46.1)
IMU_INT1: 01 - rpiInterface (J1.7), 03 - IMU (R38.1 TP7.1)
IMU_INT2: 01 - rpiInterface (J1.11), 03 - IMU (R39.1 TP8.1)
MAG_DRDY: 01 - rpiInterface (J1.31), 03 - IMU (U5.8)
MAG_INT: 01 - rpiInterface (J1.36), 03 - IMU (U5.7)
NetJ1_37: 01 - rpiInterface (J1.37), 02 - Power (R7.1)
NFC_IRQ: 01 - rpiInterface (J1.22), 06- NFC (U10.23)
NFC_RST#: 01 - rpiInterface (J1.18), 06- NFC (R62.2 U10.6)
NFC_SS: 00 - TitlePage (TP11.1), 01 - rpiInterface (J1.24), 06- NFC (U10.24)
PI_UART_RX: 00 - TitlePage (TP9.1), 01 - rpiInterface (J1.8), 05-usb-Debugger (R50.2)
PI_UART_TX: 00 - TitlePage (TP10.1), 01 - rpiInterface (J1.10), 05-usb-Debugger (R49.2)
SPI_MISO: 00 - TitlePage (TP13.1), 01 - rpiInterface (J1.21), 06- NFC (R58.1)
SPI_MOSI: 00 - TitlePage (TP14.1), 01 - rpiInterface (J1.19), 06- NFC (R59.1)
SPI_SCK: 00 - TitlePage (TP12.1), 01 - rpiInterface (J1.23), 06- NFC (R60.1)
USB_N: 02 - Power (D4.3 J5.A7 J5.B7), 05-usb-Debugger (U9.5)
USB_P: 02 - Power (D4.2 J5.A6 J5.B6), 05-usb-Debugger (U9.4)

## Assembly variants
Development: not fitted R1 R2 R13 R16 R32 R33 R34 R36 R67 R68